# EAGLE board tf534 (EAGLE 8.7.0), part 1 of 2
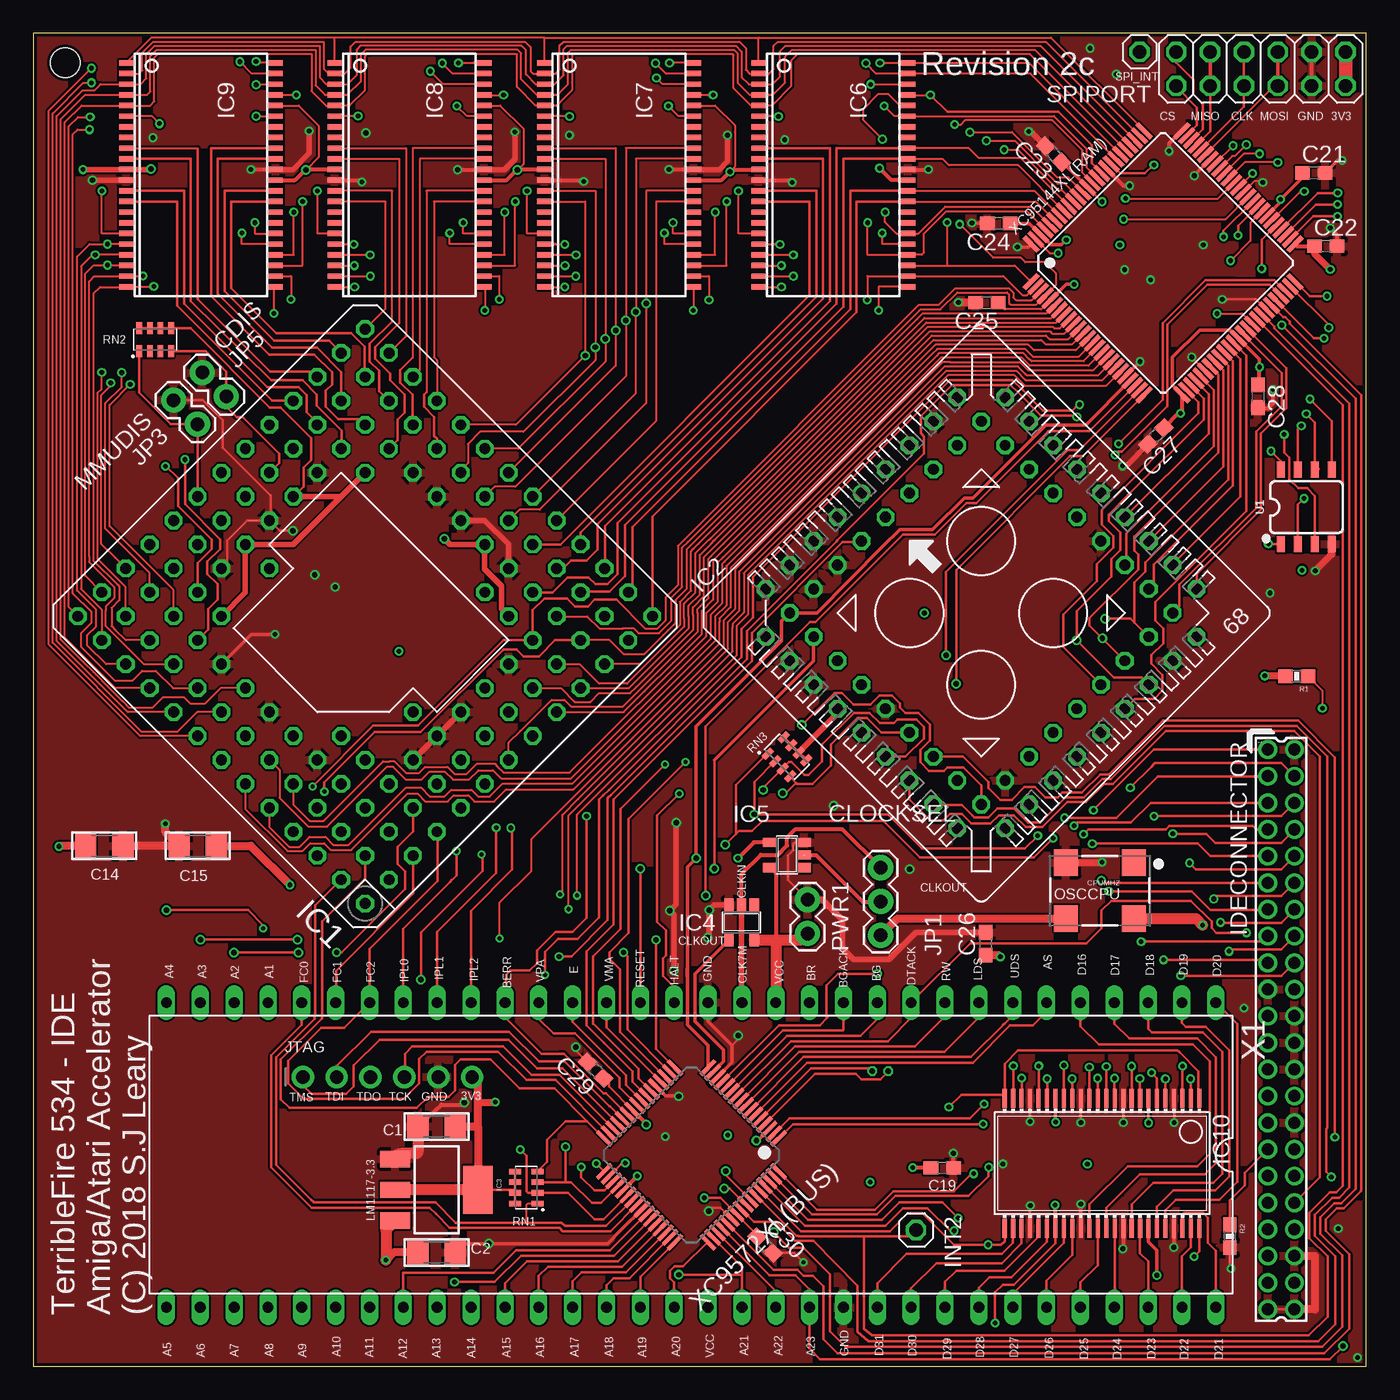
[diagram p4: board, top side]
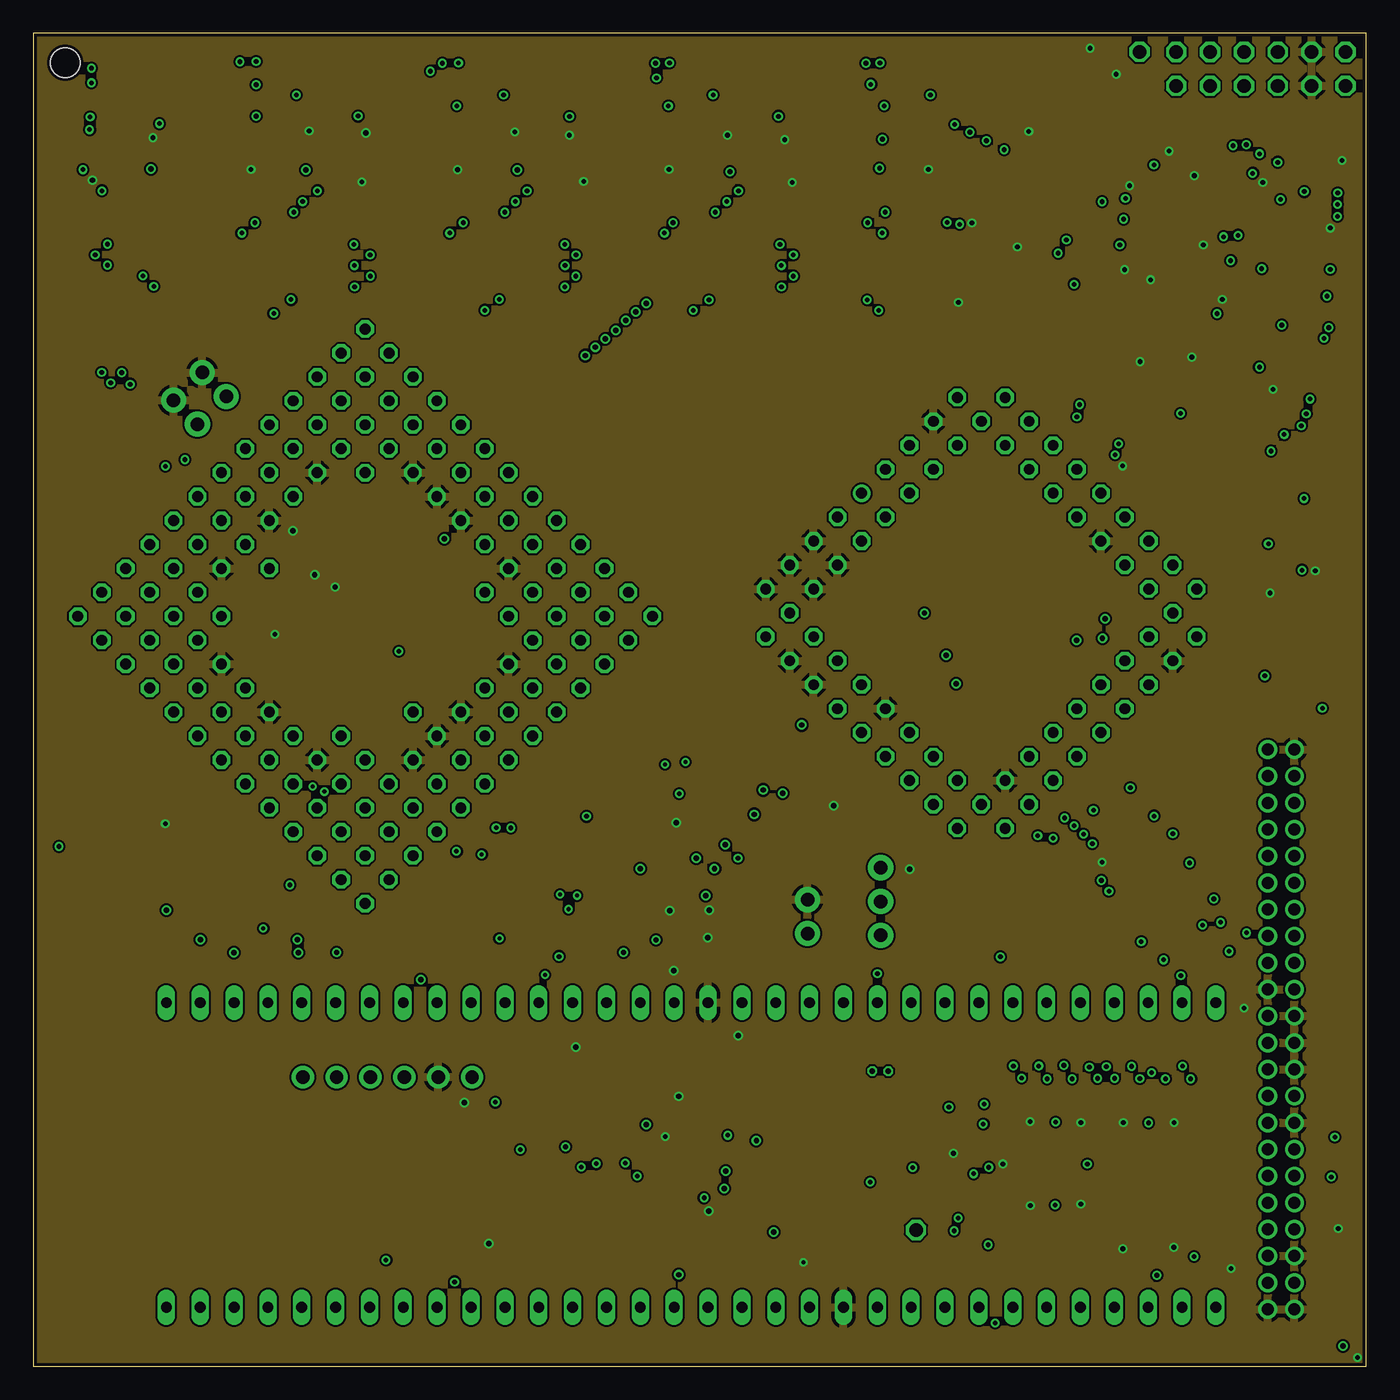
[diagram p5: board, inner layer GND]
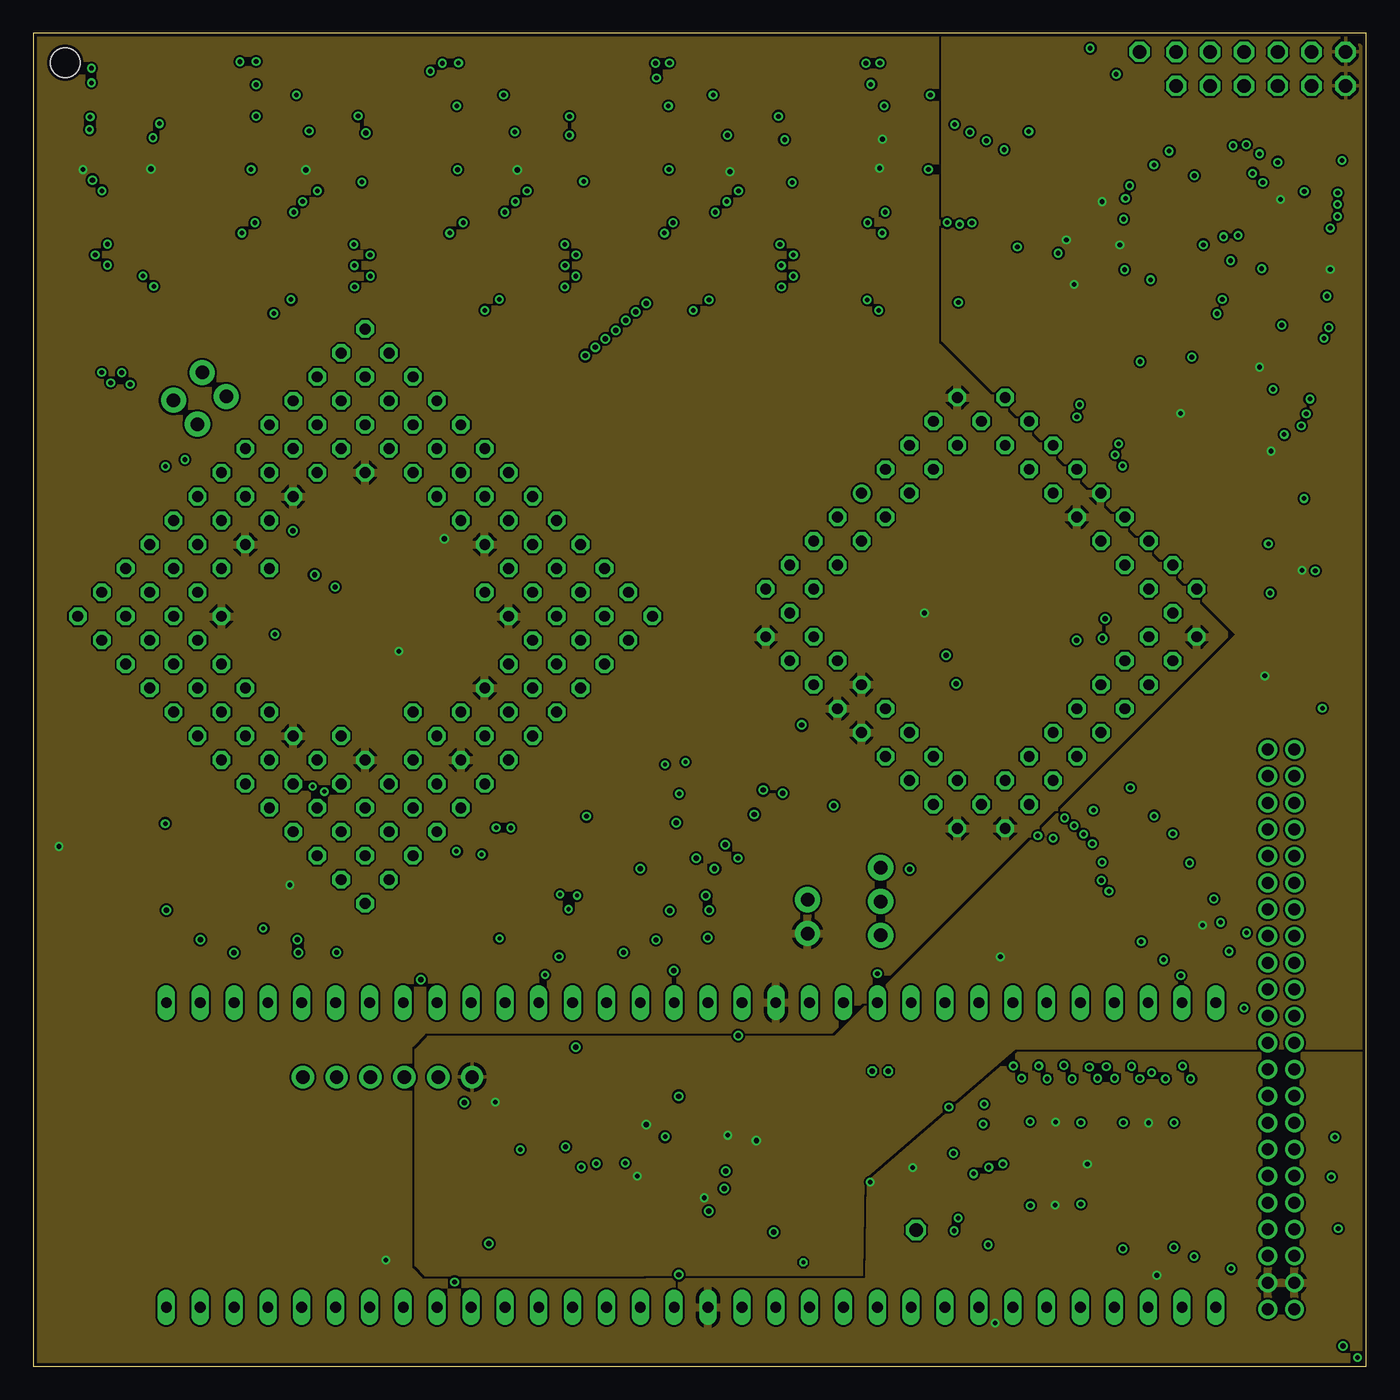
[diagram p6: board, inner layer Route15]
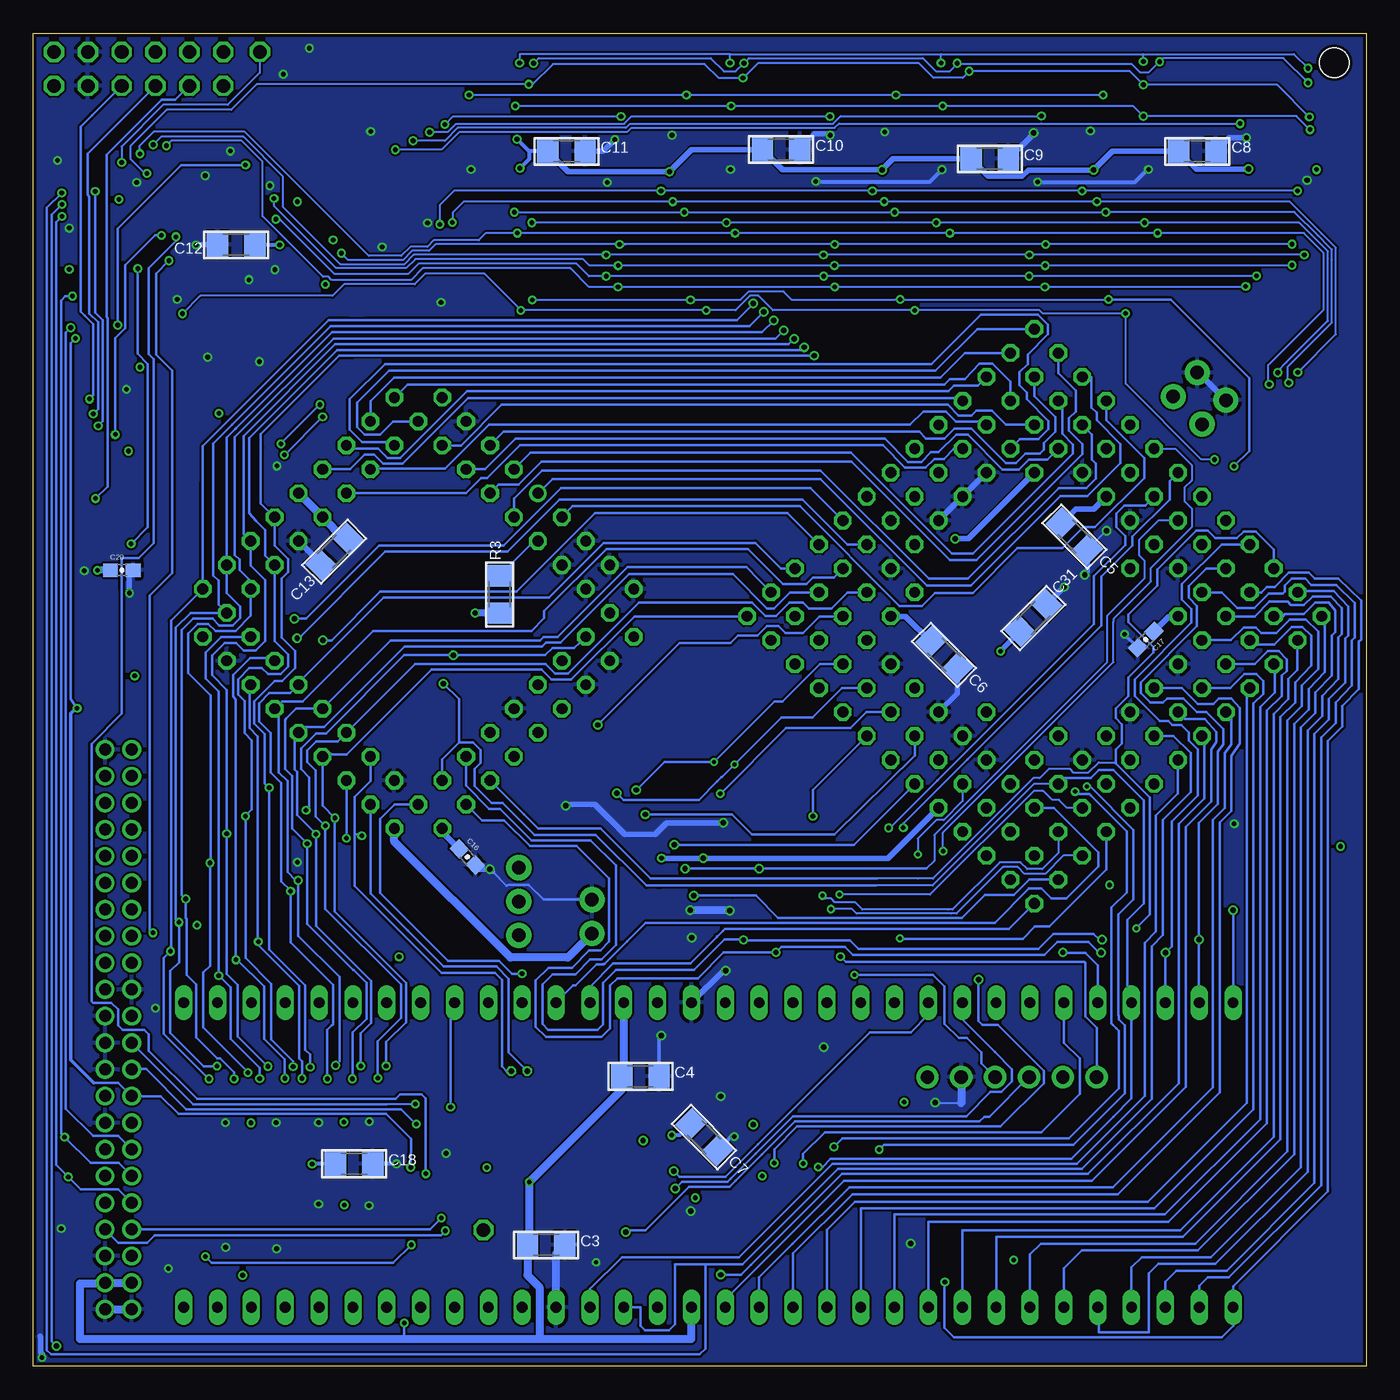
[diagram p7: board, bottom side, seen from below]

Size 100 x 100 mm. Coordinates in mm from the lower left corner, seen from the top.
Outline: 0,0 100,0 100,100 0,100 0,0
Copper layers (1*2*15*16): Top 0.035mm / dielectric 0.2mm / GND 0.0175mm / dielectric 1.2mm / Route15 0.0175mm / dielectric 0.2mm / Bottom 0.035mm
Design rules "dirtypcbs_4_layer *": minimum track width 5mil, minimum drill 12mil, track to track 6mil, track to pad 7mil, pad to pad 6mil, via to via 6mil, smd to smd 0mil, copper to edge 10mil, drill to drill 10mil, minimum pad ring 10mil, minimum via ring 6mil, stop-mask expansion 2mil, vias tented up to drill 25mil, thermal gap 10mil
Holes 2.2 mm at 2.39,97.79

## Footprints (pad centres in the part's own frame; a part is rotated, then mirrored left to right if it is on the bottom)
1206 = smd 1.6 x 1.8: 1 -1.4,0; 2 1.4,0
0603-CAP = smd 1.1 x 1: 1 -0.85,0; 2 0.85,0
C0603 = smd 1.1 x 1: 1 -0.85,0; 2 0.85,0
MPGA128 = drill 0.813 octagon: A01 -15.24,15.24; A02 -12.7,15.24; A03 -10.16,15.24; A04 -7.62,15.24; A05 -5.08,15.24; A06 -2.54,15.24; A07 0,15.24; A08 2.54,15.24; A09 5.08,15.24; A10 7.62,15.24; A11 10.16,15.24; A12 12.7,15.24; A13 15.24,15.24; B01 -15.24,12.7; B02 -12.7,12.7; B03 -10.16,12.7; B04 -7.62,12.7; B05 -5.08,12.7; B06 -2.54,12.7; B07 0,12.7; B08 2.54,12.7; B09 5.08,12.7; B10 7.62,12.7; B11 10.16,12.7; B12 12.7,12.7; B13 15.24,12.7; C01 -15.24,10.16; C02 -12.7,10.16; C03 -10.16,10.16; C04 -7.62,10.16; C05 -5.08,10.16; C06 -2.54,10.16; C07 0,10.16; C08 2.54,10.16; C09 5.08,10.16; C10 7.62,10.16; C11 10.16,10.16; C12 12.7,10.16; C13 15.24,10.16; D01 -15.24,7.62; D02 -12.7,7.62; D03 -10.16,7.62; D04 -7.62,7.62; D05 -5.08,7.62; D10 7.62,7.62; D11 10.16,7.62; D12 12.7,7.62; D13 15.24,7.62; E01 -15.24,5.08; E02 -12.7,5.08; E03 -10.16,5.08; E11 10.16,5.08; E12 12.7,5.08; E13 15.24,5.08; F01 -15.24,2.54; F02 -12.7,2.54; F03 -10.16,2.54; F04 -7.62,2.54; F10 7.62,2.54; F11 10.16,2.54; F12 12.7,2.54; F13 15.24,2.54; G01 -15.24,0; G02 -12.7,0; G03 -10.16,0; G11 10.16,0; G12 12.7,0; G13 15.24,0; H01 -15.24,-2.54; H02 -12.7,-2.54; H03 -10.16,-2.54; H11 10.16,-2.54; H12 12.7,-2.54; H13 15.24,-2.54; J01 -15.24,-5.08; J02 -12.7,-5.08; J03 -10.16,-5.08; J11 10.16,-5.08; J12 12.7,-5.08; J13 15.24,-5.08; K01 -15.24,-7.62; K02 -12.7,-7.62; K03 -10.16,-7.62; K04 -7.62,-7.62; K05 -5.08,-7.62; K10 7.62,-7.62; K11 10.16,-7.62; K12 12.7,-7.62; K13 15.24,-7.62; L01 -15.24,-10.16; L02 -12.7,-10.16; L03 -10.16,-10.16; L04 -7.62,-10.16; L05 -5.08,-10.16; L06 -2.54,-10.16; L07 0,-10.16; L08 2.54,-10.16; L09 5.08,-10.16; L10 7.62,-10.16; L11 10.16,-10.16; L12 12.7,-10.16; L13 15.24,-10.16; M01 -15.24,-12.7; M02 -12.7,-12.7; M03 -10.16,-12.7; M04 -7.62,-12.7; M05 -5.08,-12.7; M06 -2.54,-12.7; M07 0,-12.7; M08 2.54,-12.7; M09 5.08,-12.7; M10 7.62,-12.7; M11 10.16,-12.7; M12 12.7,-12.7; M13 15.24,-12.7; N01 -15.24,-15.24; N02 -12.7,-15.24; N03 -10.16,-15.24; N04 -7.62,-15.24; N05 -5.08,-15.24; N06 -2.54,-15.24; N07 0,-15.24; N08 2.54,-15.24; N09 5.08,-15.24; N10 7.62,-15.24; N11 10.16,-15.24; N12 12.7,-15.24; N13 15.24,-15.24
PLCC68-S = drill 0.813: 1 0,12.7 | drill 0.813 octagon: 2 0,10.16; 3 -2.54,12.7; 4 -2.54,10.16; 5 -5.08,12.7; 6 -5.08,10.16; 7 -7.62,12.7; 8 -7.62,10.16; 9 -10.16,12.7; 10 -12.7,10.16; 11 -10.16,10.16; 12 -12.7,7.62; 13 -10.16,7.62; 14 -12.7,5.08; 15 -10.16,5.08; 16 -12.7,2.54; 17 -10.16,2.54; 18 -12.7,0; 19 -10.16,0; 20 -12.7,-2.54; 21 -10.16,-2.54; 22 -12.7,-5.08; 23 -10.16,-5.08; 24 -12.7,-7.62; 25 -10.16,-7.62; 26 -12.7,-10.16; 27 -10.16,-12.7; 28 -10.16,-10.16; 29 -7.62,-12.7; 30 -7.62,-10.16; 31 -5.08,-12.7; 32 -5.08,-10.16; 33 -2.54,-12.7; 34 -2.54,-10.16; 35 0,-12.7; 36 0,-10.16; 37 2.54,-12.7; 38 2.54,-10.16; 39 5.08,-12.7; 40 5.08,-10.16; 41 7.62,-12.7; 42 7.62,-10.16; 43 10.16,-12.7; 44 12.7,-10.16; 45 10.16,-10.16; 46 12.7,-7.62; 47 10.16,-7.62; 48 12.7,-5.08; 49 10.16,-5.08; 50 12.7,-2.54; 51 10.16,-2.54; 52 12.7,0; 53 10.16,0; 54 12.7,2.54; 55 10.16,2.54; 56 12.7,5.08; 57 10.16,5.08; 58 12.7,7.62; 59 10.16,7.62; 60 12.7,10.16; 61 10.16,12.7; 62 10.16,10.16; 63 7.62,12.7; 64 7.62,10.16; 65 5.08,12.7; 66 5.08,10.16; 67 2.54,12.7; 68 2.54,10.16
SOT223 = smd 1.219 x 2.235: 1 -2.311,-3.099; 2 0,-3.099; 3 2.311,-3.099 | smd 3.6 x 2.2: 4 0,3.099
SOT23-5 = smd 0.69 x 0.99: 1 -0.95,-1.29; 2 0,-1.29; 3 0.95,-1.29; 4 0.95,1.3; 5 -0.95,1.3
TSOP44-II = smd 0.4 x 1.092: 1 -8.4,-5.6; 2 -7.6,-5.6; 3 -6.8,-5.6; 4 -6,-5.6; 5 -5.2,-5.6; 6 -4.4,-5.6; 7 -3.6,-5.6; 8 -2.8,-5.6; 9 -2,-5.6; 10 -1.2,-5.6; 11 -0.4,-5.6; 12 0.4,-5.6; 13 1.2,-5.6; 14 2,-5.6; 15 2.8,-5.6; 16 3.6,-5.6; 17 4.4,-5.6; 18 5.2,-5.6; 19 6,-5.6; 20 6.8,-5.6; 21 7.6,-5.6; 22 8.4,-5.6; 23 8.4,5.6; 24 7.6,5.6; 25 6.8,5.6; 26 6,5.6; 27 5.2,5.6; 28 4.4,5.6; 29 3.6,5.6; 30 2.8,5.6; 31 2,5.6; 32 1.2,5.6; 33 0.4,5.6; 34 -0.4,5.6; 35 -1.2,5.6; 36 -2,5.6; 37 -2.8,5.6; 38 -3.6,5.6; 39 -4.4,5.6; 40 -5.2,5.6; 41 -6,5.6; 42 -6.8,5.6; 43 -7.6,5.6; 44 -8.4,5.6
SSOP48DL = smd 0.305 x 1.422: 1 -6.985,-4.877; 2 -6.35,-4.877; 3 -5.715,-4.877; 4 -5.08,-4.877; 5 -4.445,-4.877; 6 -3.81,-4.877; 7 -3.175,-4.877; 8 -2.54,-4.877; 9 -1.905,-4.877; 10 -1.27,-4.877; 11 -0.635,-4.877; 12 0,-4.877; 13 0.635,-4.877; 14 1.27,-4.877; 15 1.905,-4.877; 16 2.54,-4.877; 17 3.175,-4.877; 18 3.81,-4.877; 19 4.445,-4.877; 20 5.08,-4.877; 21 5.715,-4.877; 22 6.35,-4.877; 23 6.985,-4.877; 24 7.62,-4.877; 25 7.62,4.877; 26 6.985,4.877; 27 6.35,4.877; 28 5.715,4.877; 29 5.08,4.877; 30 4.445,4.877; 31 3.81,4.877; 32 3.175,4.877; 33 2.54,4.877; 34 1.905,4.877; 35 1.27,4.877; 36 0.635,4.877; 37 0,4.877; 38 -0.635,4.877; 39 -1.27,4.877; 40 -1.905,4.877; 41 -2.54,4.877; 42 -3.175,4.877; 43 -3.81,4.877; 44 -4.445,4.877; 45 -5.08,4.877; 46 -5.715,4.877; 47 -6.35,4.877; 48 -6.985,4.877
87758-4416 = drill 0.9 pad 1.27: 1 -21,-1; 2 -21,1; 3 -19,-1; 4 -19,1; 5 -17,-1; 6 -17,1; 7 -15,-1; 8 -15,1; 9 -13,-1; 10 -13,1; 11 -11,-1; 12 -11,1; 13 -9,-1; 14 -9,1; 15 -7,-1; 16 -7,1; 17 -5,-1; 18 -5,1; 19 -3,-1; 20 -3,1; 21 -1,-1; 22 -1,1; 23 1,-1; 24 1,1; 25 3,-1; 26 3,1; 27 5,-1; 28 5,1; 29 7,-1; 30 7,1; 31 9,-1; 32 9,1; 33 11,-1; 34 11,1; 35 13,-1; 36 13,1; 37 15,-1; 38 15,1; 39 17,-1; 40 17,1; 41 19,-1; 42 19,1; 43 21,-1; 44 21,1
1X01 = drill 1.016 octagon: 1 0,0
1X03 = drill 1.016 pad 1.88: 1 0,0; 2 2.54,0; 3 5.08,0
1X02 = drill 1.016 pad 1.88: 1 0,0; 2 2.54,0
1X06_ROUND = drill 1 pad 1.676: 1 -6.35,0; 2 -3.81,0; 3 -1.27,0; 4 1.27,0; 5 3.81,0; 6 6.35,0
OSC_7X5MM = smd 1.8 x 2: 1 -2.54,-2.1; 2 2.54,-2.1; 3 2.54,2.1; 4 -2.54,2.1
0603 = smd 1.1 x 1: 1 -0.85,0; 2 0.85,0
RESCAXE80P320X160-8N = smd 0.9 x 0.425: 1 -0.85,1.2; 2 -0.85,0.4; 3 -0.85,-0.4; 4 -0.85,-1.2; 5 0.85,-1.2; 6 0.85,-0.4; 7 0.85,0.4; 8 0.85,1.2
2X06 = drill 1.016 octagon: 1 -6.35,-1.27; 2 -6.35,1.27; 3 -3.81,-1.27; 4 -3.81,1.27; 5 -1.27,-1.27; 6 -1.27,1.27; 7 1.27,-1.27; 8 1.27,1.27; 9 3.81,-1.27; 10 3.81,1.27; 11 6.35,-1.27; 12 6.35,1.27
SO08 = smd 0.6 x 1.2: 1 -1.905,-2.8; 2 -0.635,-2.8; 3 0.635,-2.8; 4 1.905,-2.8; 5 1.905,2.8; 6 0.635,2.8; 7 -0.635,2.8; 8 -1.905,2.8
DIL64 = drill 0.813 long: 1 -39.37,-11.43; 2 -36.83,-11.43; 3 -34.29,-11.43; 4 -31.75,-11.43; 5 -29.21,-11.43; 6 -26.67,-11.43; 7 -24.13,-11.43; 8 -21.59,-11.43; 9 -19.05,-11.43; 10 -16.51,-11.43; 11 -13.97,-11.43; 12 -11.43,-11.43; 13 -8.89,-11.43; 14 -6.35,-11.43; 15 -3.81,-11.43; 16 -1.27,-11.43; 17 1.27,-11.43; 18 3.81,-11.43; 19 6.35,-11.43; 20 8.89,-11.43; 21 11.43,-11.43; 22 13.97,-11.43; 23 16.51,-11.43; 24 19.05,-11.43; 25 21.59,-11.43; 26 24.13,-11.43; 27 26.67,-11.43; 28 29.21,-11.43; 29 31.75,-11.43; 30 34.29,-11.43; 31 36.83,-11.43; 32 39.37,-11.43; 33 39.37,11.43; 34 36.83,11.43; 35 34.29,11.43; 36 31.75,11.43; 37 29.21,11.43; 38 26.67,11.43; 39 24.13,11.43; 40 21.59,11.43; 41 19.05,11.43; 42 16.51,11.43; 43 13.97,11.43; 44 11.43,11.43; 45 8.89,11.43; 46 6.35,11.43; 47 3.81,11.43; 48 1.27,11.43; 49 -1.27,11.43; 50 -3.81,11.43; 51 -6.35,11.43; 52 -8.89,11.43; 53 -11.43,11.43; 54 -13.97,11.43; 55 -16.51,11.43; 56 -19.05,11.43; 57 -21.59,11.43; 58 -24.13,11.43; 59 -26.67,11.43; 60 -29.21,11.43; 61 -31.75,11.43; 62 -34.29,11.43; 63 -36.83,11.43; 64 -39.37,11.43
TERRIBLEFIRE_VQ64 = smd 1.5 x 0.3: 1 -5.5,3.75; 2 -5.5,3.25; 3 -5.5,2.75; 4 -5.5,2.25; 5 -5.5,1.75; 6 -5.5,1.25; 7 -5.5,0.75; 8 -5.5,0.25; 9 -5.5,-0.25; 10 -5.5,-0.75; 11 -5.5,-1.25; 12 -5.5,-1.75; 13 -5.5,-2.25; 14 -5.5,-2.75; 15 -5.5,-3.25; 16 -5.5,-3.75; 33 5.5,-3.75; 34 5.5,-3.25; 35 5.5,-2.75; 36 5.5,-2.25; 37 5.5,-1.75; 38 5.5,-1.25; 39 5.5,-0.75; 40 5.5,-0.25; 41 5.5,0.25; 42 5.5,0.75; 43 5.5,1.25; 44 5.5,1.75; 45 5.5,2.25; 46 5.5,2.75; 47 5.5,3.25; 48 5.5,3.75 | smd 0.3 x 1.5: 17 -3.75,-5.5; 18 -3.25,-5.5; 19 -2.75,-5.5; 20 -2.25,-5.5; 21 -1.75,-5.5; 22 -1.25,-5.5; 23 -0.75,-5.5; 24 -0.25,-5.5; 25 0.25,-5.5; 26 0.75,-5.5; 27 1.25,-5.5; 28 1.75,-5.5; 29 2.25,-5.5; 30 2.75,-5.5; 31 3.25,-5.5; 32 3.75,-5.5; 49 3.75,5.5; 50 3.25,5.5; 51 2.75,5.5; 52 2.25,5.5; 53 1.75,5.5; 54 1.25,5.5; 55 0.75,5.5; 56 0.25,5.5; 57 -0.25,5.5; 58 -0.75,5.5; 59 -1.25,5.5; 60 -1.75,5.5; 61 -2.25,5.5; 62 -2.75,5.5; 63 -3.25,5.5; 64 -3.75,5.5
TQFP100 = smd 1.5 x 0.34: 1 -8,6; 2 -8,5.5; 3 -8,5; 4 -8,4.5; 5 -8,4; 6 -8,3.5; 7 -8,3; 8 -8,2.5; 9 -8,2; 10 -8,1.5; 11 -8,1; 12 -8,0.5; 13 -8,0; 14 -8,-0.5; 15 -8,-1; 16 -8,-1.5; 17 -8,-2; 18 -8,-2.5; 19 -8,-3; 20 -8,-3.5; 21 -8,-4; 22 -8,-4.5; 23 -8,-5; 24 -8,-5.5; 25 -8,-6; 51 8,-6; 52 8,-5.5; 53 8,-5; 54 8,-4.5; 55 8,-4; 56 8,-3.5; 57 8,-3; 58 8,-2.5; 59 8,-2; 60 8,-1.5; 61 8,-1; 62 8,-0.5; 63 8,0; 64 8,0.5; 65 8,1; 66 8,1.5; 67 8,2; 68 8,2.5; 69 8,3; 70 8,3.5; 71 8,4; 72 8,4.5; 73 8,5; 74 8,5.5; 75 8,6 | smd 0.34 x 1.5: 26 -6,-8; 27 -5.5,-8; 28 -5,-8; 29 -4.5,-8; 30 -4,-8; 31 -3.5,-8; 32 -3,-8; 33 -2.5,-8; 34 -2,-8; 35 -1.5,-8; 36 -1,-8; 37 -0.5,-8; 38 0,-8; 39 0.5,-8; 40 1,-8; 41 1.5,-8; 42 2,-8; 43 2.5,-8; 44 3,-8; 45 3.5,-8; 46 4,-8; 47 4.5,-8; 48 5,-8; 49 5.5,-8; 50 6,-8; 76 6,8; 77 5.5,8; 78 5,8; 79 4.5,8; 80 4,8; 81 3.5,8; 82 3,8; 83 2.5,8; 84 2,8; 85 1.5,8; 86 1,8; 87 0.5,8; 88 0,8; 89 -0.5,8; 90 -1,8; 91 -1.5,8; 92 -2,8; 93 -2.5,8; 94 -3,8; 95 -3.5,8; 96 -4,8; 97 -4.5,8; 98 -5,8; 99 -5.5,8; 100 -6,8

## Placement (x,y rotation side)
C1  10uF  [1206]  30.25,17.98 180 top
C2  10uF  [1206]  30.25,8.53 0 top
C3  10uF  [1206]  61.52,9.09 0 bottom
C4  10uF  [1206]  54.46,21.74 0 bottom
C5  10uF  [1206]  21.89,62.26 315 bottom
C6  10uF  [1206]  31.67,53.37 315 bottom
C7  10uF  [1206]  49.67,17.19 315 bottom
C8  10uF  [1206]  12.67,91.15 0 bottom
C9  10uF  [1206]  28.24,90.58 0 bottom
C10  10uF  [1206]  43.9,91.28 0 bottom
C11  10uF  [1206]  60,91.14 0 bottom
C12  10uF  [1206]  84.78,84.13 180 bottom
C13  10uF  [1206]  77.42,61.11 225 bottom
C14  10uF  [1206]  5.33,39.04 0 top
C15  10uF  [1206]  12.34,39.04 180 top
C16  0.1uF  [0603-CAP]  67.44,38.2 315 bottom
C17  0.1uF  [0603-CAP]  16.54,54.51 225 bottom
C18  100nF  [1206]  75.93,15.18 0 bottom
C19  [C0603]  68.19,14.88 0 top
C20  0.1uF  [0603-CAP]  93.35,59.72 0 bottom
C21  [C0603]  96.07,89.53 0 top
C22  [C0603]  96.97,84.03 0 top
C23  [C0603]  76.55,90.93 135 top
C24  [C0603]  72.43,85.73 180 top
C25  [C0603]  71.54,79.79 180 top
C26  [C0603]  71.45,31.69 90 top
C27  [C0603]  84.22,69.8 225 top
C28  [C0603]  91.88,72.76 270 top
C29  [C0603]  42.18,22.21 135 top
C30  [C0603]  54.9,9.09 315 top
C31  10uF  [1206]  24.97,56.14 45 bottom
IC1  [MPGA128]  24.89,56.26 135 top
IC2  [PLCC68-S]  71.12,56.52 45 top
IC3  LM1117-3.3  [SOT223]  30.25,13.23 270 top
IC4  74LVC1G17DBV  [SOT23-5]  53.14,33.3 180 top
IC5  74LVC1G17DBV  [SOT23-5]  56.55,38.35 90 top
IC6  AS6C800855ZIN  [TSOP44-II]  60.02,89.38 270 top
IC7  AS6C800855ZIN  [TSOP44-II]  43.94,89.38 270 top
IC8  AS6C800855ZIN  [TSOP44-II]  28.22,89.38 270 top
IC9  AS6C800855ZIN  [TSOP44-II]  12.57,89.38 270 top
IC10  74AC16245  [SSOP48DL]  80.5,15.23 180 top
IDECONNECTOR  87758-4416  [87758-4416]  93.62,25.26 270 top
INT2  [1X01]  66.22,10.22 0 top
JP1  CLOCKSEL  [1X03]  63.58,37.4 270 top
JP3  MMUDIS  [1X02]  10.52,72.47 315 top
JP5  CDIS  [1X02]  12.67,74.55 315 top
JTAG  JTAG  [1X06_ROUND]  26.57,21.69 0 top
OSCCPU  CPUMHZ  [OSC_7X5MM]  80.02,35.68 180 top
PWR1  EXT5V  [1X02]  58.09,35 270 top
R1  1K  [0603]  94.79,51.76 180 top
R2  1K  [0603]  89.77,9.76 270 top
R3  47K  [1206]  65.02,57.91 90 bottom
RN1  CAY16-103J4LF  [RESCAXE80P320X160-8N]  36.98,13.41 180 top
RN2  CAY16-103J4LF  [RESCAXE80P320X160-8N]  9.14,77.01 90 top
RN3  CAY16-103J4LF  [RESCAXE80P320X160-8N]  56.54,45.72 45 top
SPI_INT  NONE  [1X01]  83,98.62 0 top
SPIPORT  SPI PORT  [2X06]  92.1,97.33 180 top
U1  3.3V SPI Flash  [SO08]  95.52,64.47 0 top
X1  MC68000  [DIL64]  49.35,15.85 180 top
XC9572XL(BUS)  TERRIBLEFIRE_XC9572XL-VQ64  [TERRIBLEFIRE_VQ64]  49.38,15.85 225 top
XC95144XL(RAM)  XC95144XL-TQ100  [TQFP100]  84.76,82.78 45 top

## Tracks (layer width: path | path; a pad name or v marks a point on that pad's centre or on a via)
A0  (via drill 0.41)
  Top 0.152: 37.01,10.77 37.01,12.09 37.12,12.21 RN1.1
  Top 0.2: 65.23,62.38 67.63,62.38 70.01,64.77 70.75,64.77 76.15,70.17 76.5,70.17 | 79.22,70.17 XC95144XL(RAM).23
  Top 0.203: IC1.A02 21.16,34.57 21.16,26.26 21.12,26.26 21.12,26.06 18.21,23.16 18.21,19.98 | XC9572XL(BUS).39 42.98,10.52 39.88,10.52 39.62,10.77 37.01,10.77 31.7,10.77 30.16,12.3 21.03,12.3 20.84,12.49 | 65.23,62.38 58.67,55.83 58.27,55.83 50.44,48.01 v50.44,35.31 | 18.21,19.98 18.21,19.87 | 18.21,19.87 18.21,19.98 | 18.21,19.87 18.21,15.12 20.84,12.49 | 21.02,12.32 20.84,12.49 | 79.22,70.17 76.5,70.17 76.18,70.17 76.18,70.16
  Bottom 0.2: 47.57,35.31 45.79,35.31 44.12,33.63 30.32,33.63 28.61,35.34
  Bottom 0.203: 47.57,35.31 v50.44,35.31 | 28.61,35.34 26.43,35.34 25.27,36.5 IC1.A02
A1  (via drill 0.35, 0.41 pad 0.61)
  Top 0.2: 77.78,68.28 78.74,68.28 XC95144XL(RAM).25
  Top 0.203: v69.24,51.21 69.24,59.74 77.78,68.28 | v41.1,14.94 41.1,14.19 42.09,13.2 42.84,13.2 XC9572XL(BUS).35
  Bottom 0.152: 36.79,36.07 32.54,36.07 24.92,43.69 IC1.C04
  Bottom 0.2: 17.58,27.3 17.93,27.66 17.93,33.48 16.68,34.73 16.68,42.44 18.99,44.74 20.04,44.74 20.66,44.13 22.66,44.13 IC1.C04
  Bottom 0.203: 17.58,27.3 X1.29 | 36.79,36.07 52.91,36.07 53.19,36.07 54,36.07 57.81,39.87 62.4,39.87 64.79,42.26 65.64,42.26 66.9,43.53 66.9,44.81 66.45,45.26 66.45,46.23 67,46.79 68.07,46.79 | 68.07,46.79 69.32,45.53 IC2.25 | 68.07,46.79 68.07,50.04 v69.24,51.21 | X1.29 17.57,27.25 17.57,25.98 | X1.29 17.6,25.99 | v41.1,14.94 40.8,14.94 40.18,15.56 22.12,15.56 18.98,18.7 17.6,20.08 X1.29
A2  (via drill 0.35, 0.41 pad 0.61)
  Top 0.2: XC9572XL(BUS).18 44.57,25.25 44.57,30.75 v44.28,31.04
  Top 0.203: v15.06,31.04 v19.89,31.04 | IC2.24 67.57,42.1 69.68,42.1 70.47,41.31 70.62,41.16 71.64,41.16 72.32,41.84 73.56,41.84 74.61,40.8 75.55,40.8 77.42,42.67 78.83,42.67 80.2,44.04 80.86,44.04 84.86,48.04 94.78,48.04 97.09,45.73 97.09,17.88 97.01,17.8 97.01,14.56 v97.38,14.2 | XC95144XL(RAM).52 96.03,86.27 v97.85,86.27
  Bottom 0.2: 20.16,31.04 20.05,31.04 | 20.05,31.04 v19.89,31.04 | v44.28,31.04 43.86,31.46 39.09,31.46 38.5,30.87 24.13,30.87 23.16,31.85 20.86,31.85 20.05,31.04 | 12.65,44.76 12.65,44.61 | v15.06,31.04 14.59,31.51 14.59,40.88
  Bottom 0.203: 12.65,44.76 12.65,46.28 13.31,46.94 13.31,47.55 13.87,48.11 14.53,48.11 14.83,48.41 15.49,48.41 17.37,50.29 17.37,51.51 13.11,55.78 13.11,56.79 13.82,57.51 13.82,58.67 10.84,61.65 IC1.D13 | X1.30 v15.06,31.04 | v44.28,31.04 48.21,31.04 50.14,29.11 56.19,29.11 56.72,28.57 56.72,25.35 57.38,24.69 61.54,24.69 62.31,25.45 62.31,28.93 61.36,29.88 59.6,29.88 58.29,31.19 57.45,31.19 56.79,31.85 56.79,36.58 59.24,39.03 62.74,39.03 64.67,40.96 66.34,40.96 IC2.24 | IDECONNECTOR.35 93.62,13.26 96.44,13.26 v97.38,14.2 98.27,15.1 98.27,85.85 v97.85,86.27 | 12.65,44.61 12.65,42.82 14.59,40.88
A3  (via drill 0.35, 0.41 pad 0.61)
  Top 0.203: v12.55,32 v19.81,32 | v46.72,31.99 46.72,28.54 46.72,23.81 XC9572XL(BUS).17 | IC2.23 69.73,45.74 71.65,43.82 71.65,43.39 72.55,42.49 73.4,42.49 74.37,43.46 75.15,43.46 75.93,42.68 76.86,42.68 77.21,43.03 78.68,43.03 80.05,44.4 80.71,44.4 84.75,48.43 94.89,48.43 97.65,45.67 v97.65,17.19 | XC95144XL(RAM).50 95.76,80.26 v97.05,80.28
  Bottom 0.2: v46.72,31.99 46.66,31.93 38.72,31.93 38.09,31.31 24.6,31.31 23.47,32.44 20.47,32.44 20.03,32 v19.81,32
  Bottom 0.203: IC1.D12 11.98,59.85 13.31,58.52 13.31,57.66 12.7,57.05 12.7,55.52 16.92,51.31 16.92,50.49 16.2,49.78 15.24,49.78 14.94,50.09 13.72,50.09 12.7,49.07 11.99,49.07 10.72,47.8 10.72,46.63 11.12,46.13 11.12,42.19 12.55,40.77 v12.55,32 12.55,27.3 X1.31 | IC2.23 67.53,43.55 65.79,41.81 64.98,41.81 62.61,39.45 58.19,39.45 56.29,37.55 56.29,31.6 57.38,30.5 58.22,30.5 59.32,29.4 61.03,29.4 61.8,28.63 61.8,25.68 61.37,25.25 57.66,25.25 57.25,25.65 57.25,28.75 56.29,29.72 50.44,29.72 48.16,32 46.73,32 v46.72,31.99 46.7,32 | IDECONNECTOR.33 93.61,15.25 95.71,15.25 v97.65,17.19 97.92,17.45 97.92,79.95 97.6,80.28 v97.05,80.28
A4  (via drill 0.3, 0.35, 0.41)
  Top 0.152: IC1.C13 6.14,60.65 5.11,61.69 5.11,72.87 5.81,73.57 v5.81,73.77 | IC9.26 19.54,83.38 v19.54,86.58 | IC8.26 35.37,83.38 v35.37,86.58 | IC7.26 51.16,83.38 v51.16,86.58 | v63.91,86.58 63.91,85.83 64.77,84.98 IC6.28 66.4,84.98 68.42,87 74.88,87 XC95144XL(RAM).96
  Top 0.2: v17.26,32.84 17.26,33.09 16.13,34.21
  Top 0.203: 16.13,34.21 v9.98,34.21 | IC2.22 65.73,42.5 67.29,40.94 68.25,40.94 68.76,41.45 69.66,41.45 70.4,40.71 71.82,40.71 72.44,41.33 73.58,41.33 74.46,40.45 75.7,40.45 77.57,42.32 78.98,42.32 80.35,43.69 81,43.69 84.98,47.66 94.61,47.66 96.53,45.74 96.53,14.17 IDECONNECTOR.36
  Bottom 0.152: v5.81,73.77 5.88,73.84 5.87,73.84 5.87,75.01 2.58,78.3 2.58,82.99 | 3.64,84.84 2.75,83.95 2.58,83.77 2.58,82.99 | 3.64,84.84 | 3.64,84.84 5.38,86.58 v19.54,86.58 v35.37,86.58 v51.16,86.58 v63.91,86.58 64.08,86.58 | 2.58,82.99 | 32.54,36.58 33.63,36.58 | 33.63,36.58 36.72,36.58 | 18.8,45.31 20.07,45.31 20.86,44.51 21.92,44.51 22.21,44.8 23.81,44.8 24.49,44.12 24.96,44.12 32.51,36.58 33.63,36.58
  Bottom 0.2: v17.26,32.84 17.27,32.85 16.24,33.88 16.24,42.66 18.8,45.21 18.8,45.31 18.8,45.49
  Bottom 0.203: IC1.C13 6.93,61.29 8.28,62.64 9.2,62.64 9.7,62.13 11.33,62.13 11.89,62.69 12.75,62.69 15.67,59.77 15.67,58.57 17.86,56.39 17.86,55.83 15.98,53.95 15.98,53.55 17.86,51.68 17.86,50.9 17.86,50.29 18.8,49.35 18.8,48.62 18.34,48.16 18.34,46.74 18.8,46.28 18.8,45.49 | X1.32 v9.98,34.21 | IC2.22 63.19,41.4 62.13,40.34 57.45,40.34 53.7,36.58 36.72,36.58
A5  (via drill 0.35)
  Top 0.152: IC8.28 32.25,84.98 v32.25,85.79 | IC1.C12 8.73,59.52 5.41,62.84 5.41,72.25 6.63,73.47 v6.63,74.55 | IC9.28 16.63,84.98 v16.63,85.79 | IC7.28 48,84.98 v48,85.79 | v62.6,85.79 62.6,83.38 IC6.26 66.66,83.38 66.83,83.56 66.83,84.98 68.5,86.65 74.53,86.65 XC95144XL(RAM).97
  Top 0.203: v31.61,6.32 34.62,6.32 36.59,8.29 43.58,8.29 XC9572XL(BUS).43
  Bottom 0.152: 2.88,83.12 2.88,83.65 3.95,84.72 5.02,85.79 v16.63,85.79 v32.25,85.79 v48,85.79 v62.6,85.79 | v6.63,74.55 6.63,74.67 5.99,75.32 2.91,78.4 2.88,78.43 2.88,83.12 | 2.88,83.12
  Bottom 0.203: IC1.C12 7.88,58.06 7.47,58.47 6.86,58.47 5.79,59.54 4.32,59.54 3.86,59.08 2.08,59.08 0.38,57.45 0.38,54.53 0.56,54.36 0.56,50.8 1.78,49.53 1.78,48.01 2.87,46.91 2.87,13.38 2.87,13.23 2.87,13.11 9.98,5.99 X1.33 | 10.01,4.42 X1.33 | v31.61,6.32 31.63,6.29 31.63,2.88 30.93,2.18 10.83,2.18 9.98,3.03 X1.33
A6  (via drill 0.35)
  Top 0.152: IC8.24 34.96,81.78 v34.96,80.03 | IC9.24 19.33,81.78 v19.33,80.03 | IC7.24 50.69,81.78 v50.69,80 | v62.56,80 62.56,81.78 IC6.24 72.78,81.78 74.22,80.34 74.54,80.34 XC95144XL(RAM).2
  Top 0.203: IC1.D11 12.32,60.26 13.37,61.31 13.37,62.01 10.86,64.53 10.86,66.62 9.94,67.54 | 9.94,67.54 | 9.94,67.54 v9.91,67.52
  Bottom 0.152: v62.56,80 v50.69,80 46.97,80 46.34,80.62 43.72,80.62 43.13,80.03 v34.96,80.03 v19.33,80.03
  Bottom 0.203: IC1.D11 10.81,58.06 9.65,56.9 8.38,56.9 7.32,57.96 6.25,57.96 6.1,58.12 6.1,58.57 5.59,59.08 4.57,59.08 4.12,58.62 2.23,58.62 0.86,57.25 0.86,54.66 1.07,54.46 1.07,51.05 2.29,49.78 2.29,48.26 3.38,47.17 3.38,13.58 10.3,6.66 11.88,6.66 12.52,6.01 X1.34 | v9.91,67.52 8.77,68.66 8.77,74.13 14.67,80.03 v19.33,80.03
A7  (via drill 0.35)
  Top 0.152: IC1.B13 3.89,59.31 3.89,81.97 4.52,82.6 v5.56,82.6 6.95,82.6 IC9.20 | IC8.20 v24.1,82.58 | IC7.20 v39.9,82.58 | IC6.20 v56.12,82.58 | v81.94,87.61 88.88,87.61 XC95144XL(RAM).64
  Bottom 0.152: v5.56,82.6 5.58,82.58 v24.1,82.58 v39.9,82.58 v56.12,82.58 | v56.12,82.58 56.13,82.58 | v56.12,82.58 58.26,82.58 58.76,83.07 71.33,83.07 72.01,82.39 77.29,82.39 81.94,87.04 v81.94,87.61
  Bottom 0.203: IC1.B13 5.03,58.17 2.44,58.17 1.35,57 1.35,54.81 1.57,54.59 1.57,51.31 2.79,50.04 2.79,48.51 3.89,47.42 3.89,39 3.89,13.75 10.47,7.16 14.23,7.16 15.06,6.33 X1.35
A8  (via drill 0.35)
  Top 0.152: IC1.B12 6.89,56.26 6.89,58.5 4.8,60.59 4.8,72.99 5.13,73.32 v5.13,74.56 | IC9.25 20.2,82.58 v20.2,87.38 | IC8.25 36.16,82.58 v36.16,87.38 | IC7.25 52.02,82.58 v52.02,87.38 | v68.56,85.8 68.56,84.71 68.56,82.62 68.6,82.58 | IC6.25 68.6,82.58 | 68.6,82.58 73.64,82.58 XC95144XL(RAM).1
  Bottom 0.152: v5.13,74.56 2.27,77.42 2.27,83.9 2.63,84.26 3.34,84.97 | 3.34,84.97 | 3.34,84.97 5.75,87.38 v20.2,87.38 v36.16,87.38 v52.02,87.38 67.7,87.38 68.54,86.53 v68.56,85.8
  Bottom 0.203: IC1.B12 6.27,56.26 6.1,56.44 4.67,56.44 3.81,57.3 2.79,57.3 2.31,56.69 2.31,55.09 2.59,54.81 2.59,51.82 3.81,50.55 3.81,49.02 4.9,47.93 4.9,14.93 11.65,8.18 16.83,8.18 17.6,7.4 X1.36
A9  (via drill 0.35)
  Top 0.152: IC1.C11 10.52,58.22 5.71,63.02 5.71,72.12 v7.26,73.67 | v7.26,73.67 | IC9.27 15.64,84.18 v15.64,85.01 | IC7.27 47.35,84.18 v47.35,85.01 | IC8.27 31.24,84.18 v31.24,85.01 | IC6.27 63.7,84.18 v63.7,85.01 | XC95144XL(RAM).66 90.1,90.24 90.34,90.48 90.82,90.96 v92.01,90.96
  Bottom 0.152: 7.19,73.75 v7.26,73.67 7.35,73.75 7.35,75.11 3.19,79.27 3.19,83.25 | 3.19,83.25 3.19,83.52 4.68,85.01 v15.64,85.01 v31.24,85.01 v47.35,85.01 v63.7,85.01 66.05,85.01 66.59,84.47 69.95,84.47 70.44,83.99 71.71,83.99 72.39,83.3 74.84,83.3 84.18,92.64 90.95,92.64 92.01,91.58 v92.01,90.96 | 3.19,83.25
  Bottom 0.203: IC1.C11 8.36,56.26 7.26,57.35 5.89,57.35 5.64,57.1 4.67,57.1 4.01,57.76 2.64,57.76 1.83,56.9 1.83,54.94 2.08,54.69 2.08,51.56 3.3,50.29 3.3,48.77 4.39,47.68 4.39,14.6 11.32,7.67 15.6,7.67 16.31,6.96 16.31,2.54 20.07,2.54 20.07,4.42 X1.37
A10  (via drill 0.35)
  Top 0.152: IC1.A13 2.67,56.94 2.67,93.02 3.37,93.72 v4.26,93.72 | IC9.42 16.76,96.18 v16.72,96.14 | IC8.42 30.75,96.18 v29.78,97.15 | v62.83,96.17 62.84,96.18 IC6.42 | IC7.42 47.21,96.18 v46.75,96.65 | v91.48,89.5 XC95144XL(RAM).63
  Bottom 0.152: v4.26,93.72 6.68,96.14 v16.72,96.14 17.73,97.15 v29.78,97.15 30.27,96.67 32.45,96.67 33.54,97.75 45.65,97.75 v46.75,96.65 46.76,96.63 48.57,96.63 49.63,97.69 61.02,97.69 62.53,96.17 v62.83,96.17 83.23,96.17 85.15,94.26 89.99,94.26 92.71,91.53 92.71,90.58 91.63,89.5 v91.48,89.5
  Bottom 0.203: IC1.A13 3.1,56.07 3.1,52.07 4.32,50.8 4.32,49.28 5.41,48.18 5.41,15.89 12.62,8.69 21.33,8.69 22.68,7.33 X1.38
A11  (via drill 0.35)
  Top 0.152: IC8.23 33.88,80.92 v33.88,79.22 | 18.05,80.86 IC9.23 18.04,80.85 v18.04,78.99 | IC7.23 49.52,80.96 v49.52,79.21 | IC6.23 63.42,80.98 v63.42,79.21 | v88.81,78.97 90.69,78.97 XC95144XL(RAM).41
  Top 0.203: IC1.C10 13.11,55.25 13.11,56.79 13.82,57.51 13.82,58.67 13.06,59.44 13.06,60.35 14.02,61.32 14.02,62.03 11.38,64.67 v11.38,68.03
  Bottom 0.152: v88.81,78.97 87.46,80.32 77.55,80.32 76.69,81.18 71.39,81.18 70.61,81.96 66.16,81.96 v63.42,79.21 v49.52,79.21 47.32,79.21 46.22,80.31 45.6,80.31 44.51,79.22 v33.88,79.22 24.5,79.22 24.28,79 v18.04,78.99 18.04,73.72 12.35,68.03 v11.38,68.03
  Bottom 0.203: IC1.C10 10.15,54.47 9.2,55.42 8.28,55.42 7.87,55.02 6.76,55.02 5.74,56.03 4.52,56.03 3.61,55.12 3.61,52.32 4.83,51.05 4.83,49.53 5.92,48.44 5.92,16.11 12.83,9.2 24.41,9.2 25.22,8.38 X1.39
A12  (via drill 0.35)
  Top 0.152: IC1.B11 6.93,54.47 6.16,55.24 5.88,55.52 5.88,56.89 6.46,57.48 6.46,58.5 6.31,58.64 | v9.04,81.02 9.01,80.98 IC9.22 5,80.97 4.5,80.47 4.5,60.46 6.31,58.64 | IC8.22 22.63,80.97 v24.11,80.97 | IC7.22 38.36,80.97 v39.88,80.97 | IC6.22 54.43,80.97 v56.13,80.97 | XC95144XL(RAM).68 | XC95144XL(RAM).68 v90.02,91.57 | 6.31,58.64 6.33,58.63
  Top 0.203: X1.40 27.76,7.01 34.54,7.01 36.22,8.69 43.27,8.69 XC9572XL(BUS).42
  Bottom 0.152: v9.04,81.02 9.09,80.97 v24.11,80.97 v39.88,80.97 55.54,80.97 55.55,80.97 v56.13,80.97 58.32,80.97 59.71,82.36 70.78,82.36 71.66,81.48 77.62,81.48 77.86,81.73 78.26,81.73 82.81,86.28 82.81,90.37 84.36,91.92 89.67,91.92 v90.02,91.57
  Bottom 0.203: X1.40 27.76,9.7 13.75,9.7 6.43,17.03 6.43,48.69 5.33,49.78 5.33,51.31 4.12,52.58 4.12,54.81 4.78,55.47 5.59,55.47 6.91,54.15 8.41,54.15 IC1.B11
A13  (via drill 0.35)
  Top 0.152: IC9.19 v4.64,83.38 4.44,83.38 3.58,82.52 3.58,58.32 5.13,56.76 5.13,56.54 IC1.A12 | 53.9,83.38 IC6.19 v57.02,83.38 | IC8.19 v25.27,83.38 | IC7.19 v40.71,83.38 | XC95144XL(RAM).67 89.94,90.79 90.14,90.79 v91,91.65
  Bottom 0.152: v4.64,83.38 v25.27,83.38 v40.71,83.38 v57.02,83.38 71.45,83.38 72.14,82.69 76.97,82.69 81.28,87.01 81.28,89.27 84.23,92.23 | 84.23,92.23 | 84.23,92.23 90.42,92.23 v91,91.65
  Bottom 0.203: X1.41 30.3,10.21 13.95,10.21 6.93,17.22 6.93,48.95 5.84,50.04 5.84,51.56 5.18,52.22 5.18,54.42 IC1.A12
A14  (via drill 0.35)
  Top 0.152: IC1.B10 10.51,52.65 8.32,52.65 5.44,55.53 5.44,56.7 5.44,57 6.08,57.63 6.08,58.45 4.19,60.34 4.19,60.75 4.19,81.39 4.57,81.77 6.96,81.77 IC9.21 8.21,81.78 v8.22,81.8 | IC8.21 v25.29,81.78 | IC7.21 v40.71,81.78 | IC6.21 v57.02,81.78 | v81.81,86.06 89.46,86.06 XC95144XL(RAM).61
  Bottom 0.152: v8.22,81.8 8.24,81.78 v25.29,81.78 v40.71,81.78 v57.02,81.78 58.32,81.78 59.24,82.7 71.11,82.7 71.87,81.94 77.39,81.94 81.52,86.06 v81.81,86.06
  Bottom 0.203: X1.42 32.84,10.82 14.84,10.82 7.44,18.22 7.44,49.2 6.35,50.29 6.35,51.82 5.94,52.17 5.94,53.03 6.55,53.65 7.37,53.65 8.34,52.67 IC1.B10
A15  (via drill 0.35)
  Top 0.152: IC9.18 v5.56,84.18 4.21,84.18 3.28,83.25 3.28,58.37 3.28,58.24 3.28,58.19 4.71,56.76 4.71,55.5 4.06,54.85 4.06,54.06 5.45,52.67 IC1.A11 | 39.16,84.18 IC7.18 38.36,84.17 v39.88,84.17 | IC8.18 22.63,84.17 v24.05,84.17 | IC6.18 54.44,84.17 v56.01,84.17 | XC95144XL(RAM).99 76.26,83.5 v76.9,83.5
  Top 0.203: XC9572XL(BUS).44 43.88,7.87 37.03,7.87 35.38,6.22 X1.43
  Bottom 0.152: v5.56,84.18 5.58,84.17 v24.05,84.17 v39.88,84.17 v56.01,84.17 | v56.01,84.17 55.54,84.17 | v56.01,84.17 69.83,84.17 70.31,83.68 71.58,83.68 72.27,83 76.39,83 v76.9,83.5
  Bottom 0.203: X1.43 35.38,11.38 15.11,11.38 7.96,18.53 7.96,49.45 6.86,50.55 6.86,52.59 IC1.A11
A16  (via drill 0.35)
  Top 0.152: IC1.B09 10.48,50.87 9.18,52.17 8.15,52.17 7.45,51.46 6.09,51.46 3.6,53.95 3.6,55.01 4.36,55.78 4.36,56.59 2.97,57.98 2.97,58.48 2.97,92.43 3.31,92.78 v4.22,92.78 | v16.72,93.78 IC9.39 | IC8.39 32.54,93.78 v31.77,94.54 | IC7.39 48.41,93.78 v47.65,94.54 | v63.84,94.54 64.6,93.78 IC6.39 76.58,93.78 79.02,91.35 79.02,89.94 XC95144XL(RAM).86
  Top 0.203: XC9572XL(BUS).45 44.18,7.47 38.61,7.47 37.92,6.78 X1.44
  Bottom 0.152: v4.22,92.78 5.23,93.78 v16.72,93.78 17.48,94.54 v31.77,94.54 v47.65,94.54 v63.84,94.54
  Bottom 0.203: X1.44 37.92,11.84 15.88,11.84 8.46,19.25 8.46,19.61 8.46,49.7 7.72,50.44 7.72,51.41 8.23,51.92 9.14,51.92 10.19,50.87 IC1.B09
A17
  Top 0.152: IC1.A10 6.15,50.87 4.86,52.16 | 4.66,52.37 | 4.66,52.37 4.07,52.96 2.36,54.66 2.36,93.32 3.62,94.58 IC9.5 8.77,94.58 9.09,94.89 9.09,98.17 9.37,98.45 20.87,98.45 20.87,95.66 21.95,94.58 IC8.5 22.64,94.6 23.75,94.6 24.88,95.74 24.88,98.29 25.04,98.45 36.21,98.45 36.29,98.37 36.29,95.99 37.7,94.58 IC7.5 39.25,94.58 39.25,94.56 40.41,95.72 40.41,96.3 | 4.86,52.16 | 4.86,52.16 4.66,52.37 | XC95144XL(RAM).80 74.75,98.44 74.75,98.45 57.35,98.45 56.88,97.97 56.88,96.06 55.4,94.58 IC6.5 53.84,94.58 52.54,95.89 52.54,98.37 52.45,98.45 40.47,98.45 40.41,98.39 40.41,96.3 | 40.41,96.3
  Top 0.203: XC9572XL(BUS).46 44.48,7.06 41.15,7.06 40.46,6.38 X1.45
  Bottom 0.203: X1.45 40.46,10.24 38.35,12.34 16.37,12.34 8.97,19.74 8.97,50.63 IC1.A10 8.97,50.63
A18
  Top 0.152: IC1.C08 14.05,50.87 12.86,49.68 11.79,49.68 11.3,50.17 9.72,50.17 8.93,49.38 7.21,49.38 6.74,49.85 6.67,49.92 | 6.67,49.92 5.55,51.04 4.71,51.89 4.53,52.06 | 4.53,52.06 | 4.53,52.06 3.76,52.83 2.06,54.54 2.06,93.56 3.88,95.38 5.94,95.38 arc-90 5.94,95.38 IC9.4 8.54,95.38 8.78,95.63 8.78,97.22 | 6.67,49.92 | 8.78,97.22 | 8.78,97.22 8.78,98.3 9.24,98.75 21.18,98.75 21.18,96.09 21.89,95.38 IC8.4 23.54,95.38 24.58,96.42 24.58,98.42 24.92,98.75 36.34,98.75 36.59,98.5 36.59,96.55 37.76,95.38 IC7.4 39.32,95.38 40.11,96.17 40.11,98.36 40.1,98.37 40.1,98.51 40.34,98.75 52.58,98.75 52.84,98.49 52.84,96.29 53.75,95.38 IC6.4 55.49,95.38 56.4,96.3 56.4,98.24 56.92,98.75 75.15,98.75 XC95144XL(RAM).79
  Top 0.203: XC9572XL(BUS).47 44.73,6.6 43.54,6.6 43,6.07 X1.46
  Bottom 0.203: X1.46 43,8.46 38.56,12.9 18.62,12.9 11,20.53 11,40.79 10.11,41.67 10.11,45.77 9.47,46.74 9.47,49.38 10.11,50.09 11.07,50.09 11.48,49.68 12.65,49.68 13.84,50.87 IC1.C08
A19
  Top 0.152: IC1.A09 7.08,49.08 6.37,49.8 5.25,50.91 | 5.25,50.91 | 5.25,50.91 4.4,51.76 | 4.4,51.76 | 4.4,51.76 3.46,52.71 | 3.46,52.71 | 3.46,52.71 1.75,54.41 1.75,93.79 3.69,95.73 4.59,95.73 5.02,96.16 arc-90 5.04,96.18 IC9.3 8.04,96.18 8.47,96.62 8.47,98.42 9.11,99.06 21.48,99.06 21.48,96.69 21.98,96.19 IC8.3 23.58,96.18 24.24,96.84 24.24,98.77 24.53,99.06 36.62,99.06 36.95,98.73 36.95,96.92 37.68,96.18 IC7.3 39.11,96.18 39.79,96.87 39.79,98.81 40.05,99.06 52.71,99.06 53.15,98.62 53.15,96.71 53.68,96.18 IC6.3 55.46,96.18 56.03,96.75 56.03,98.65 56.44,99.06 75.55,99.06 XC95144XL(RAM).78
  Top 0.203: XC9572XL(BUS).48 45.54,6.71 X1.47
  Bottom 0.203: X1.47 45.54,6.66 43.03,9.17 38.79,13.41 19.01,13.41 11.51,20.91 11.51,41 10.62,41.89 10.62,46 10.11,46.66 10.11,48.66 IC1.A09
A20  (via drill 0.35)
  Top 0.152: IC1.B08 12.3,49.08 10.81,47.59 8.14,47.59 1.45,54.28 1.45,93.98 3.75,96.29 v4.36,96.29 | XC95144XL(RAM).82 74.82,96.97 74.82,96.98 IC6.43 63.23,96.99 v62.46,97.76 | IC8.43 31.46,96.98 v30.68,97.76 | IC7.43 47.46,96.98 v46.68,97.76 | IC9.43 16.4,96.98 v15.51,97.87
  Top 0.203: X1.48 48.08,6.29 47.78,6.59 47.78,7.14 48.11,7.48 48.76,7.48 50.59,9.31 XC9572XL(BUS).49
  Bottom 0.152: v62.46,97.76 62.09,98.13 49.19,98.13 48.19,97.14 47.3,97.14 v46.68,97.76 46.31,98.13 33.26,98.13 32.27,97.14 31.25,97.14 30.68,97.71 | 30.68,97.71 v30.68,97.76 | 30.68,97.71 17.6,97.71 16.98,97.08 16.3,97.08 v15.51,97.87 15.25,98.13 6.21,98.13 v4.36,96.29
  Bottom 0.203: X1.48 48.08,5 39.17,13.92 20.58,13.92 13.54,20.96 13.54,38.97 13.54,40.45 11.63,42.35 11.63,46.28 11.23,46.84 11.23,47.6 12.09,48.56 13.6,48.56 IC1.B08
A21  (via drill 0.35, 0.41)
  Top 0.152: IC1.A08 8.02,47.28 1.14,54.16 1.14,94.19 4.33,97.38 v4.36,97.38 | 32.99,97.78 IC8.44 31.91,97.78 v31.9,97.77 | IC9.44 16.82,97.78 v16.72,97.89 | XC95144XL(RAM).81 74.71,97.78 IC6.44 v63.52,97.78 | IC7.44 v47.73,97.78 47.71,97.78
  Top 0.203: XC9572XL(BUS).50 53.16,7.47 53.16,6.88 | 53.16,6.88 X1.50 | v48.41,6.86 53.14,6.86 53.16,6.88
  Bottom 0.152: 16.72,98.44 5.41,98.44 v4.36,97.38 | 31.89,98.44 16.72,98.44 | 47.72,98.44 31.89,98.44 | 47.72,98.44 63.51,98.44 63.52,98.43 v63.52,97.78 | v16.72,97.89 16.72,98.44 | v31.9,97.77 31.89,97.78 31.89,98.44 | v47.73,97.78 47.72,97.79 47.72,98.44
  Bottom 0.203: IC1.A08 12.14,47.1 12.14,44.6 12.14,42.59 14.07,40.66 14.07,21.23 20.87,14.43 39.32,14.43 46.15,7.62 46.91,6.86 v48.41,6.86
A22  (via drill 0.35)
  Top 0.203: X1.51 55.7,5.64 XC9572XL(BUS).51 | v97.87,88.02 96.36,88.02 XC95144XL(RAM).54
  Bottom 0.2: 13.16,44.96 13.16,44.64 | 16.08,26.26 16.08,31.5 15.24,32.34 15.24,41
  Bottom 0.203: IC1.B07 14.46,47.28 13.16,46.02 13.16,44.96 | X1.51 54.46,4.42 54.46,3.05 54.1,2.69 52.32,2.69 51.87,3.15 51.87,7.64 49.61,7.64 | 49.61,7.64 47.88,7.64 47.88,7.65 47.88,7.64 46.81,7.64 39.65,14.81 21.34,14.81 16.08,20.07 16.08,26.26 | 49.61,7.64 arc90 49.58,7.62 49.58,1.32 50.01,0.89 96.97,0.89 97.38,0.89 | v97.87,88.02 98.98,86.91 98.98,1.21 98.67,0.89 97.42,0.89 | 97.42,0.89 97.38,0.89 | 97.42,0.89 97.38,0.89 | 13.16,44.64 13.16,43.09 15.24,41
A23  (via drill 0.35, 0.41)
  Top 0.203: XC9572XL(BUS).52 55.21,6.83 57.17,6.83 58.24,5.76 X1.52 58.22,4.4 58.22,1.35 59.02,0.51 97.28,0.51 v98.27,1.5 | XC95144XL(RAM).53 93.97,84.9 96.22,87.16 v97.85,87.16
  Bottom 0.2: 16.61,26.26 16.61,31.76 15.76,32.61 15.76,41.34 | IC1.A07 14.12,44.19
  Bottom 0.203: IC1.A07 14.29,45.31 | X1.52 58.23,5.79 55.84,8.18 47.04,8.18 40.03,15.19 36.99,15.19 21.7,15.19 16.61,20.28 16.61,26.26 | v97.85,87.16 98.63,86.38 98.63,1.86 v98.27,1.5 | 14.12,44.19 14.12,42.98 15.76,41.34
A24
  Top 0.152: IC1.A06 15.91,41.81 19.07,38.66 20.2,38.66 20.77,39.23 21.83,39.23 22.32,38.73 23.86,38.73 28.08,42.95 28.82,42.95 29.41,42.37 31.08,42.37 31.54,42.83 32.64,42.83 33.1,42.37 34.58,42.37 35.48,43.27 40.52,43.27 51.48,54.23 51.48,55.84 | XC95144XL(RAM).16 79.17,75.06 74.75,75.06 74.34,75.47 | 74.34,75.47 | 74.34,75.47 74.15,75.67 68.09,75.67 52.32,59.9 52.32,56.95 51.48,56.11 51.48,55.84 | 51.48,55.84
A25
  Top 0.152: IC1.B06 18.48,44.71 18.48,42.63 20.62,40.49 22.05,40.49 26.51,44.96 27,44.96 27.95,44.02 29.13,44.02 29.72,44.61 30.87,44.61 31.48,44 32.69,44 33.39,44.7 34.48,44.7 35.08,44.1 40.35,44.1 50.83,54.58 50.83,56.38 51.67,57.22 51.67,60.17 51.86,60.36 | XC95144XL(RAM).14 78.4,75.71 75.02,75.71 74.99,75.74 | 74.99,75.74 | 74.99,75.74 74.42,76.31 67.82,76.31 67.44,75.94 | 67.44,75.94 | 67.44,75.94 62.97,71.47 51.86,60.36 | 51.86,60.36
A26
  Top 0.152: IC1.A05 17.71,40.45 19.2,38.96 19.97,38.96 20.72,39.71 21.92,39.71 22.51,39.12 23.67,39.12 27.95,43.41 29.09,43.41 29.75,42.75 30.86,42.75 31.35,43.24 32.87,43.24 33.37,42.74 34.23,42.74 35.2,43.71 40.45,43.71 51.15,54.41 51.15,55.7 | XC95144XL(RAM).15 78.79,75.39 74.89,75.39 74.67,75.61 | 74.67,75.61 | 67.76,75.8 67.95,75.99 74.29,75.99 74.67,75.61 | 67.76,75.8 | 67.76,75.8 52,60.03 52,57.09 51.15,56.24 51.15,55.7 | 51.15,55.7
A27
  Top 0.152: XC95144XL(RAM).13 78.2,76.22 75.07,76.22 74.65,76.64 67.68,76.64 67.3,76.26 62.99,71.95 51.73,60.69 | 51.73,60.69 | 51.73,60.69 51.32,60.28 51.32,57.33 50.5,56.51 50.5,54.8 40.24,44.54 35.27,44.54 34.84,44.97 34.61,45.2 33.28,45.2 32.5,44.42 31.62,44.42 31.08,44.97 29.4,44.97 28.9,44.48 28.01,44.48 27.1,45.38 26.72,45.38 26.23,45.38 21.78,40.92 20.74,40.92 19.5,42.16 IC1.B05
A28  (via drill 0.3)
  Top 0.152: 68.77,75.34 | 68.77,75.34 68.22,75.34 52.84,59.96 | 68.77,75.34 74.02,75.34 74.62,74.74 79.55,74.74 XC95144XL(RAM).17 | 52.84,59.96 52.65,59.77 52.65,56.82 51.8,55.97 51.8,53.99 37.36,39.55 37.36,37.17 34.97,34.78 v34.97,32.1 | 52.84,59.96
  Bottom 0.2: IC1.A04 19.5,37.25 23.77,32.98 24.84,32.98 25.76,32.07 34.94,32.07 v34.97,32.1
A29  (via drill 0.3)
  Top 0.152: 68.63,75.01 | 68.63,75.01 68.36,75.01 52.98,59.63 52.98,56.68 52.13,55.84 52.13,53.81 40.87,42.55 39.69,41.37 39.69,35.57 v39.51,35.38 | 68.63,75.01 73.88,75.01 74.44,74.45 74.55,74.34 79.89,74.34 80.87,75.33 XC95144XL(RAM).18
  Bottom 0.152: IC1.B04 22.45,41.89 23.04,42.48 23.56,42.48 24.23,43.15 24.95,43.15 32.72,35.38 v39.51,35.38
A30  (via drill 0.3)
  Top 0.152: 52.46,55.43 52.46,55.7 53.31,56.54 53.31,59.49 68.5,74.68 73.75,74.68 74.44,73.99 80.21,73.99 XC95144XL(RAM).19 | 52.46,55.43 | 52.46,55.43 52.46,53.63 40.17,41.33 40.17,34.31 v40.15,34.29
  Bottom 0.152: v40.15,34.29 38.58,34.29 38.24,33.96 31.13,33.96 30.73,33.96 27.25,37.44 26.14,37.44 25.64,36.94 24.08,36.94 22.73,38.3 IC1.A03
A31  (via drill 0.3)
  Top 0.152: 74.38,73.58 | 74.38,73.58 73.81,74.14 73.61,74.35 68.63,74.35 53.64,59.35 53.64,56.41 52.79,55.56 52.79,53.37 40.8,41.38 v40.8,35.3 | 74.38,73.58 74.41,73.55 80.49,73.55 XC95144XL(RAM).20
  Bottom 0.152: IC1.B03 23.1,38.5 24.3,37.3 25.44,37.3 25.94,37.81 27.48,37.81 31.03,34.26 31.36,34.26 37.8,34.26 38.34,34.8 39.84,34.8 40.13,35.09 40.59,35.09 v40.8,35.3 40.8,35.16
AS
  Top 0.203: XC9572XL(BUS).6 58.05,22.76 70.48,22.76 73.28,25.55 75.01,25.55 76.02,26.57 X1.6
AS20  (via drill 0.3, 0.41 pad 0.41)
  Top 0.152: IC1.J02 39.58,50.87 40.61,49.84 41.79,49.84 42.45,50.49 42.72,50.49 | 42.72,50.49 | 49.49,56.38 | 49.49,56.38 49.49,56.93 50.34,57.77 50.34,60.72 50.72,61.11 | 50.72,61.11 | 50.72,61.11 51.28,61.67 51.45,61.84 | 51.45,61.84 | 51.45,61.84 67.26,77.65 76.25,77.65 76.42,77.48 77.35,77.48 XC95144XL(RAM).10 | 42.72,50.49 44.77,50.49 45.21,50.93 47.78,53.5 49.49,55.21 49.49,56.38
  Top 0.2: v47.4,45.15 44.05,41.8 44.05,32.81 41.98,30.75 41.98,26.01 41.98,25.7
  Top 0.203: 57.22,43.77 57.3,43.69 58.47,43.69 59.84,45.06 59.84,46.63 61.82,48.62 62.53,48.62 63.62,47.53 IC2.21 | 57.22,43.77 56.79,44.2 RN3.4 | 41.99,25.7 41.98,25.7 | XC9572XL(BUS).22 45.39,21.61 45.39,22.31 41.98,25.72 41.98,26.01 | 57.22,43.77 56.43,42.98 v56.22,42.98
  Bottom 0.2: 41.55,48.67 43.88,48.67 v47.4,45.15
  Bottom 0.203: 41.55,48.67 39.35,50.87 IC1.J02 | v56.22,42.98 55.72,42.49 50.06,42.49 48.69,43.86 48.69,43.87 48.35,44.21 48.34,44.21 v47.4,45.15
AVEC  (via drill 0.3, 0.35, 0.41)
  Top 0.2: v29.08,29.01 29.08,32.54 33.72,37.17 33.72,38.32 v33.65,38.39
  Top 0.203: XC9572XL(BUS).34 44.08,15.14 44.08,15.15 44.16,15.24 v44.41,15.24
  Bottom 0.152: IC1.E02 30.28,42.4 31.7,40.98 32.26,40.98 33.65,39.59 v33.65,38.39
  Bottom 0.203: v29.08,29.01 29.08,25.91 28.78,25.61 27.64,25.61 24.18,22.16 24.18,21.23 27.43,17.98 42.7,17.98 44.41,16.27 v44.41,15.24
BERR  (via drill 0.35)
  Top 0.2: 35.38,28.09 X1.22 35.46,27.36 35.46,29.36 35.78,29.68 37.24,29.68 37.79,30.22 37.79,31.18 39.19,32.59 40.45,32.59 41.51,33.64 v41.51,41.25
  Top 0.203: 35.36,27.3 X1.22 35.38,26.18 38.13,23.43 39.48,23.43 | 39.48,23.43 39.78,23.43 | XC9572XL(BUS).27 42.98,20.47 42.76,20.47 39.8,23.43 39.48,23.43
  Bottom 0.2: IC1.H01 41.52,43.23
  Bottom 0.203: 41.52,43.23 41.52,41.27 v41.51,41.25
BG
  Top 0.203: XC9572XL(BUS).11 56.55,24.79 62.06,24.79 63.32,26.05 X1.11
BG20
  Top 0.203: 41.56,18.36 39.1,20.83 36.47,20.83 34.29,23.01 32.06,23.01 31.65,22.6 31.65,20.7 31.16,20.22 29.62,20.22 28.77,19.37 19.21,19.37 18.57,20.02 18.57,23.01 21.67,26.11 21.67,33.35 24.89,36.58 IC1.B02 | 41.56,18.36 XC9572XL(BUS).32 | RN1.4 38.55,15.33 38.55,16.58 38.55,16.97 39.95,18.36 41.56,18.36
BGACK
  Top 0.203: 56.25,25.2 60.76,25.2 60.78,25.22 X1.12 | 56.25,25.2 | 56.25,25.2 XC9572XL(BUS).12
  Bottom 0.2: IC1.C03 23.42,41.89 20.08,38.56 20.08,37.49 22.49,35.09 23.62,35.09 24.37,35.84 25.31,35.84 27.88,33.27 28.18,33.27
  Bottom 0.203: 28.04,33.27 28.18,33.27 29.77,33.27 54.05,33.27 55.48,31.85 57.15,30.18 57.21,30.18 57.23,30.15 57.73,30.15 59.33,28.55 59.51,28.55 X1.12
BR
  Bottom 0.2: IC1.A01 26.79,32.81 48.12,32.81 48.26,32.66
  Bottom 0.203: X1.13 58.24,28.47 56.49,30.23 50.7,30.23 48.72,32.21 | 48.72,32.21 48.72,32.26 | 48.26,32.66 48.72,32.21
BUSEN  (via drill 0.35)
  Top 0.203: IC10.48 87.48,8.62 v87.09,8.22 | IC10.25 72.88,9.38 72.6,9.11 v71.63,9.11 v71.63,9.1 69.05,9.1 66.7,11.45 65.59,11.45 64.26,10.12 57.59,10.12 XC9572XL(BUS).60
  Bottom 0.203: v87.09,8.22 86.62,7.75 72.99,7.75 v71.63,9.11
CBACK
  Top 0.152: 51,59.9 | 51,59.9 51,60.45 67.54,76.99 75.63,76.99 75.94,76.67 77.95,76.67 XC95144XL(RAM).12 | 51,59.9 51,57.5 50.15,56.66 50.15,54.94 47.98,52.77 45.87,50.66 | IC1.J01 44.29,49.08 45.87,50.66 | 45.87,50.66
CBREQ
  Top 0.152: 41.08,50.84 IC1.K01 44.69,50.87 44.88,51.07 | 49.16,56.25 | 49.16,56.25 49.16,57.07 50.01,57.91 50.01,60.86 50.39,61.25 50.83,61.68 51.12,61.98 | 51.12,61.98 | 51.12,61.98 67.13,77.98 76.49,77.98 76.6,77.87 77.02,77.87 XC95144XL(RAM).9 | 44.88,51.07 | 44.88,51.07 47.66,53.85 49.16,55.35 49.16,56.25
CDIS
  Top 0.203: RN2.4 12.94,76.16 14.47,74.63 JP5.2 14.47,71.99 15.24,71.22 15.7,71.22 18.44,68.48 18.44,67.77 IC1.H12
CIIN
  Top 0.152: 49.92,61.71 49.54,61.33 49.34,61.13 49.34,58.19 48.5,57.34 48.5,55.62 47.48,54.6 47.42,54.54 45.55,52.67 IC1.L01 | 49.92,61.71 | 49.92,61.71 66.85,78.64 76.38,78.64 XC95144XL(RAM).7
CLK7M
  Top 0.254: XC9572XL(BUS).15 51.08,22.18 51.77,22.86 51.77,23.72 49.63,25.86 49.63,29.44 IC4.4
CLK7M_RAW
  Top 0.305: JP1.1 60.68,40.3 57.19,40.3 56.56,39.67 56.56,39.06 55.87,38.37 54.58,38.37 53.14,36.93 IC4.2
  Top 0.406: X1.15 53.14,27.28 53.14,33.2 IC4.2
CLKCPU  (via drill 0.35, 0.41)
  Top 0.254: 49.07,29.26 49.07,25.6 50.62,24.06 XC9572XL(BUS).16 | XC95144XL(RAM).22 78.97,70.62 75.96,70.62 70.49,65.15 69.99,65.15 69.86,65.15 67.47,62.76 65.01,62.76 63.72,61.48 58.78,56.52 IC2.11 56.13,55.9 56.13,54.41 49.73,48.01 v49.73,38.1 49.07,37.44 49.07,29.82
  Top 0.305: 49.07,29.26 49.07,29.82 | IC5.4 54.06,39.3 v52.87,38.11
  Bottom 0.406: IC1.E01 35.87,38.1 v49.73,38.1 v49.74,38.11 v52.87,38.11
CLKCPU_RAW
  Top 0.305: IC5.2 58.73,38.35 62.24,34.84 63.56,34.84 JP1.2
CLKEXT
  Top 0.406: OSCCPU.3
  Top 0.61: JP1.3 64.84,33.58 OSCCPU.3
CPCS  (via drill 0.41)
  Top 0.203: v62.95,22.14 62.76,22.32 58.33,22.32 XC9572XL(BUS).5
  Bottom 0.203: v62.95,22.14 64.34,23.53 64.34,29.06 65.26,29.98 69.21,29.98 71.92,32.68 74.71,35.48 IC2.29
CPSENSE
  Top 0.2: IC2.4 62.05,61.81 60.71,61.81 53.9,55 53.9,52.9 43.53,42.53 43.53,41.87 arc90 43.53,41.87 43.53,33.13 41.51,31.11 41.51,26.4 41.51,25.66
  Top 0.203: XC9572XL(BUS).23 44.94,21.35 44.94,22.14 43.36,23.71 | 42.82,24.25 43.36,23.71 | 41.51,26.4 41.51,25.57 43.36,23.71
  Bottom 0.203: R3.2 62.43,61.9 IC2.4
D0
  Top 0.203: IC9.14 10.79,87.38 10.79,79.55 17.92,72.42 IC1.K13
  Bottom 0.203: 60.3,63.7 IC2.3 59.53,64.52 42.47,64.52 35,57.05 33.33,57.05 32.36,58.01 29.52,58.01 26.16,61.37 22.81,61.37 21.23,62.94 20.37,62.94 16.66,66.65 16.66,68.12 19.51,70.97 IC1.K13
D1
  Top 0.203: IC1.K12 21.3,70.8 20.52,71.58 20.52,72.85 19.91,73.46 17.55,73.46 11.3,79.7 11.3,88.18 IC9.13
  Bottom 0.203: IC1.K12 20.57,69.9 20.57,68.02 20.27,67.72 20.27,66.6 20.98,65.89 23.06,65.89 29.87,59.08 32.82,59.08 40.95,67.21 61.82,67.21 63.94,65.1 IC2.2
D2
  Top 0.203: IC9.9 12.32,91.36 12.32,80.06 17.75,74.62 20.9,74.62 IC1.L13
  Bottom 0.203: IC1.L13 20.62,74.22 20.62,71.93 20.22,71.53 20.22,70.97 18.44,69.19 18.44,67.77 20.93,65.28 22.96,65.28 29.67,58.57 32.97,58.57 40.95,66.55 61.04,66.55 62.09,65.5 IC2.1
D3
  Top 0.203: IC1.M13 22.91,76.22 22.18,76.96 18.06,76.96 14.35,80.67 14.35,88.18 IC9.32
  Bottom 0.203: 65.72,65.48 IC2.68 65.08,66.14 63.6,66.14 61.87,67.87 38.61,67.87 31.22,60.48 29.23,60.48 21.29,68.43 21.29,69.19 22.3,70.21 22.3,71.12 21.79,71.63 21.79,73.2 23.1,74.51 IC1.M13
D4
  Top 0.203: IC1.L12 23.1,74.59 21.29,76.4 17.91,76.4 13.84,80.47 13.84,90.58 IC9.35
  Bottom 0.203: IC2.67 62.7,68.53 38.66,68.53 31.09,60.96 29.52,60.96 22,68.48 22,69.14 22.81,69.95 22.81,72.14 arc-90 IC1.L12
D5
  Top 0.203: IC9.10 11.81,90.58 11.81,79.91 17.86,73.97 20.19,73.97 21.26,72.9 21.26,72.06 23.12,70.2 23.12,70.12 IC1.K11
  Bottom 0.203: IC2.66 66.11,67.29 63.8,69.6 36.12,69.6 34.39,67.84 33.38,67.84 32.64,68.58 32.08,68.58 30.73,69.88 29.9,69.88 27.28,67.26 26.06,67.26 25.3,68.02 23.91,68.02 IC1.K11
D6
  Top 0.203: IC9.31 14.86,87.38 14.86,80.87 18.21,77.52 23.01,77.52 23.82,77.52 24.84,76.5 24.84,74.22 IC1.M12
  Bottom 0.203: IC2.65 64.72,70.1 33.53,70.1 33.02,69.6 31.65,69.6 30.89,70.36 29.62,70.36 27.03,67.77 26.26,67.77 25.55,68.48 24.49,68.48 24.18,68.78 24.18,69.24 23.32,70.1 23.32,71.22 24.89,72.8 IC1.M12
D7
  Top 0.203: IC9.36 13.34,91.38 13.34,80.26 17.7,75.89 21.08,75.89 22.4,74.57 22.4,73.66 21.95,73.2 21.95,71.98 22.86,71.07 24.45,71.07 IC1.L11
  Bottom 0.203: IC1.L11 27.04,70.63 28.09,71.68 29.26,71.68 29.62,71.32 30.58,71.32 31.39,72.14 64.87,72.14 67.92,69.09 IC2.64
D8
  Top 0.152: IC1.N13 26.42,79.34 26.42,87.38 IC8.14
  Bottom 0.203: IC2.62 71.14,70.87 73,70.87 73.97,69.9 75.13,69.9 75.69,70.46 75.69,71.37 75.69,72.29 73.3,74.68 32.31,74.68 29.17,77.81 IC1.N13
D9
  Top 0.152: 26.92,78.38 26.92,88.18 IC8.13
  Top 0.203: IC1.M11 25.96,73.15 25.96,74.68 25.25,75.39 25.25,76.71 26.92,78.38
  Bottom 0.203: IC1.M11 26.69,73.88 28.04,75.23 29.01,75.23 30.12,74.07 31.24,74.07 31.65,73.66 71.94,73.66 IC2.60
D10
  Top 0.152: IC8.10 27.46,90.58 27.46,78.26
  Top 0.203: 27.46,78.26 25.65,76.45 25.65,75.59 26.77,74.47 26.77,73.97 27.84,72.9 27.84,71.53 27.33,71.02 27.33,69.48 IC1.L10
  Bottom 0.203: IC1.L10 25.98,69.55 24.59,69.55 23.82,70.31 23.82,70.92 25.45,72.54 25.45,73.05 26.01,73.61 26.01,74.57 25.4,75.18 25.4,75.89 23.88,77.42 23.88,78.13 24.64,78.89 28.91,78.89 32.61,75.18 73.61,75.18 76.25,72.54 76.25,70.26 75.34,69.34 73.17,69.34 IC2.59
D11
  Top 0.152: IC8.9 27.96,91.38 27.96,77.3
  Top 0.203: 27.96,77.3 IC1.N12
  Bottom 0.203: IC1.N12 30.1,76.02 31.95,74.17 72.95,74.17 74.71,72.41 IC2.58
D12
  Top 0.152: IC8.36 28.47,91.38 28.47,75.67
  Top 0.203: 28.47,75.67 27.53,74.73 27.53,73.81 28.45,72.9 28.45,70.67 arc90 IC1.M10
  Bottom 0.2: 74.68,67.26 IC2.57 74.66,67.35 69.11,67.35 65.81,70.64 65.56,70.64
  Bottom 0.203: IC1.M10 28.72,70.87 30.79,70.87 31.55,71.63 33.22,71.63 34.21,70.64 65.56,70.64
D13
  Top 0.152: IC8.35 28.98,90.58 28.98,74.72
  Top 0.203: 28.98,74.72 IC1.N11
  Bottom 0.203: IC2.56 76.25,68.83 74.12,68.83 73.41,68.12 72.49,68.12 67.46,73.15 31.33,73.15 30.93,73.56 29.15,73.56 IC1.N11
D14
  Top 0.152: IC8.32 29.49,88.18 29.49,73.07
  Top 0.203: IC1.M09 30.28,69.59 30.07,69.8 30.07,71.22 29.31,71.98 29.31,72.9 29.49,73.07
  Bottom 0.203: IC1.M09 30.94,68.83 31.7,68.07 32.41,68.07 33.07,67.41 34.59,67.41 36.27,69.09 63.5,69.09 65.94,66.65 66.4,66.65 67.55,65.5 IC2.55
D15
  Top 0.152: IC1.N10 30.28,75.48 30.06,75.7 30.06,87.38 IC8.31
  Bottom 0.2: 74.42,68.38 73.77,67.73 72.31,67.73 67.39,72.64 67.16,72.64
  Bottom 0.203: IC2.54 76.22,67.29 75.13,68.38 74.42,68.38 | IC1.N10 30.28,72.64 67.16,72.64
D16  (via drill 0.35, 0.41 pad 0.25)
  Top 0.152: IC7.14 41.4,87.38 v41.4,75.82 36.21,70.63 IC1.N09
  Top 0.203: 32.27,70.63 IC1.N09 | v79.23,22.44 IC10.14 | v82.31,43.41 83.88,44.97 | 83.88,44.97 84.12,45.22 | XC95144XL(RAM).29 87.24,73.87 88.18,72.92 88.18,69.99 IC2.50 | IDECONNECTOR.4 93.63,45.25 84.16,45.25 83.88,44.97
  Bottom 0.2: 76.01,75.82 73.69,75.82 | IC2.50 82.93,64.73 82.93,67.03 82.93,68.89
  Bottom 0.203: v41.4,75.82 73.69,75.82 | IC2.50 81.9,61.58 80.87,60.55 80.87,59.59 81.38,59.08 81.38,54.66 80.37,53.65 80.37,52.38 81.33,51.41 81.88,51.41 83.42,49.87 83.42,48.21 82.63,47.42 82.63,43.73 v82.31,43.41 82.31,31.29 79.59,28.57 79.59,23.74 79.24,23.39 v79.24,22.45 v79.23,22.44 | 82.93,68.89 82.93,69.93 77.04,75.82 76.01,75.82
D17  (via drill 0.35, 0.41 pad 0.25)
  Top 0.152: IC7.13 42.16,88.18 v42.16,76.45 42.16,75.49 36.78,70.1 33.53,70.1 32.61,69.19 32.61,67.77 32.08,67.23 IC1.M08
  Top 0.203: 32.05,67.06 IC1.M08 | v80.5,22.47 v80.5,22.46 IC10.12 | IDECONNECTOR.6 93.63,41.27 v84.09,41.27 | XC95144XL(RAM).30 87.59,74.22 88.56,73.25 88.56,69.01 82,62.45 82,60.22 IC2.49
  Bottom 0.2: 73.93,76.24 76.09,76.24
  Bottom 0.203: v42.16,76.45 42.38,76.23 73.05,76.23 73.05,76.24 73.93,76.24 | v80.5,22.47 80.5,22.88 82.14,24.52 82.14,28.67 84.09,30.62 v84.09,41.27 83.6,41.76 83.6,46.95 84.16,47.5 84.16,49.89 84.65,50.38 84.65,51.52 83.8,52.38 82.86,52.38 82.4,51.92 81.43,51.92 80.87,52.48 80.87,53.39 81.89,54.41 IC2.49 82.6,60.81 82.6,62.74 83.29,63.42 83.82,64 83.82,69.61 77.2,76.24 76.09,76.24
D18  (via drill 0.35, 0.41 pad 0.25)
  Top 0.152: IC7.10 42.93,90.58 v42.93,77.09 42.93,75.39 36.37,68.83 IC1.N08
  Top 0.203: IC1.N08 | v82.41,22.5 v82.4,22.5 IC10.9 | IC2.48 89.28,67.49 89.28,74.73 XC95144XL(RAM).33 | IDECONNECTOR.8 93.63,39.27 88.68,39.27 88,39.95 v85.49,39.95 v85.49,39.94
  Bottom 0.2: 84.23,67.03 84.23,68.6
  Bottom 0.203: 84.23,67.03 84.23,62.44 IC2.48 83.69,60.07 82.6,58.98 82.6,54.41 83.31,53.7 84.23,53.7 84.78,54.25 85.65,54.25 86.59,53.31 86.59,51.84 85.49,50.73 v85.49,39.94 85.49,29.43 84.66,28.6 84.66,24.76 v82.41,22.5 | v42.93,77.09 43.34,76.67 77.34,76.67 84.23,69.78 84.23,68.6
D19  (via drill 0.33, 0.35, 0.41 pad 0.25)
  Top 0.152: IC7.9 43.69,91.38 v43.69,77.72 43.69,75.06 IC1.N07
  Top 0.203: IC2.47 84.08,58.7 84.08,60.15 85.87,61.94 85.88,61.94 90.01,66.07 90.01,75.41 XC95144XL(RAM).35 | IC10.6 84.31,21.6 v83.89,22.02 | IDECONNECTOR.10 93.63,37.27 87.24,37.27 v86.74,37.76
  Bottom 0.2: 84.89,68.43 84.89,68.32 84.89,67.57 | 84.89,66.8 84.89,67.49
  Bottom 0.203: 84.89,66.8 84.89,60.86 84.53,60.5 84.53,59.74 83.69,58.9 IC2.47 83.69,56.31 84.84,55.14 86.31,55.14 86.87,55.68 87.68,55.68 88.39,54.97 88.39,52.02 86.69,50.32 86.69,37.81 v86.74,37.76 86.74,30.05 87.25,29.54 87.25,26.19 | v43.69,77.72 44.3,77.11 76.24,77.11 | 76.24,77.11 74.58,77.11 | 84.89,67.49 84.89,67.57 | 84.89,68.32 84.89,69.7 77.47,77.11 76.24,77.11 | 87.25,26.19 87.28,26.16 | 87.25,26.19 87.25,25.43 83.88,22.06 v83.88,22.02 v83.89,22.02
D20  (via drill 0.35, 0.41 pad 0.25)
  Top 0.152: IC7.36 44.45,91.38 v44.45,78.46 44.45,74.27 36.17,65.99 34.62,65.99 IC1.M07
  Top 0.203: IC10.5 v84.94,21.56 | IC2.46 85.49,60.17 90.56,65.25 90.56,75.56 XC95144XL(RAM).36 | IDECONNECTOR.12 93.63,35.27 88.78,35.27 v88.56,35.06
  Bottom 0.2: 85.49,66.85 85.49,68.33
  Bottom 0.203: 85.49,66.85 IC2.46 85.49,58.01 84.48,57 84.48,56.13 85.04,55.58 86.06,55.58 86.54,56.08 88.01,56.08 88.85,55.24 88.85,35.35 v88.56,35.06 88.56,33.62 88.49,33.54 88.49,29.35 87.78,28.64 87.78,24.67 86.2,23.09 85.98,23.09 84.94,22.05 v84.94,21.56 | v44.45,78.46 45.33,77.58 77.58,77.58 84.78,70.38 84.85,70.31 85.49,69.67 85.49,68.33
D21  (via drill 0.35, 0.41 pad 0.25)
  Top 0.152: IC7.35 45.21,90.58 v45.21,79.1 45.21,72.99 IC1.N06
  Top 0.203: IC10.3 v86.21,22.5 v86.22,22.51 | v89.07,33.3 89.1,33.27 93.63,33.27 IDECONNECTOR.14 | IC2.45 86,57.02 86,58.65 91.74,64.4 91.74,69.62 | XC95144XL(RAM).39 90.77,77.4 93.66,74.52 93.66,72.04 91.74,70.12 91.74,69.62 | 91.74,69.62 91.74,69.9 91.74,69.62 | 91.74,69.62
  Bottom 0.2: 86.51,66.45 86.51,67.81
  Bottom 0.203: 86.51,66.45 86.51,59.33 86.11,58.93 86.11,57.13 IC2.45 88.2,56.52 89.3,55.42 89.3,33.53 v89.07,33.3 89.07,30.29 89.71,29.65 89.71,25 87.22,22.51 v86.22,22.51 | v45.21,79.1 46.27,78.03 77.7,78.03 85.07,70.66 86.51,69.22 86.51,67.81
D22  (via drill 0.35, 0.41 pad 0.25)
  Top 0.152: IC7.32 45.97,88.18 v45.97,79.73 45.97,72.24 38,64.26 36.48,64.26 IC1.M06